# EAGLE design MMC_DSP_interface (EAGLE 9.5.1)

## Sheet 1 of 5: DSP Connections
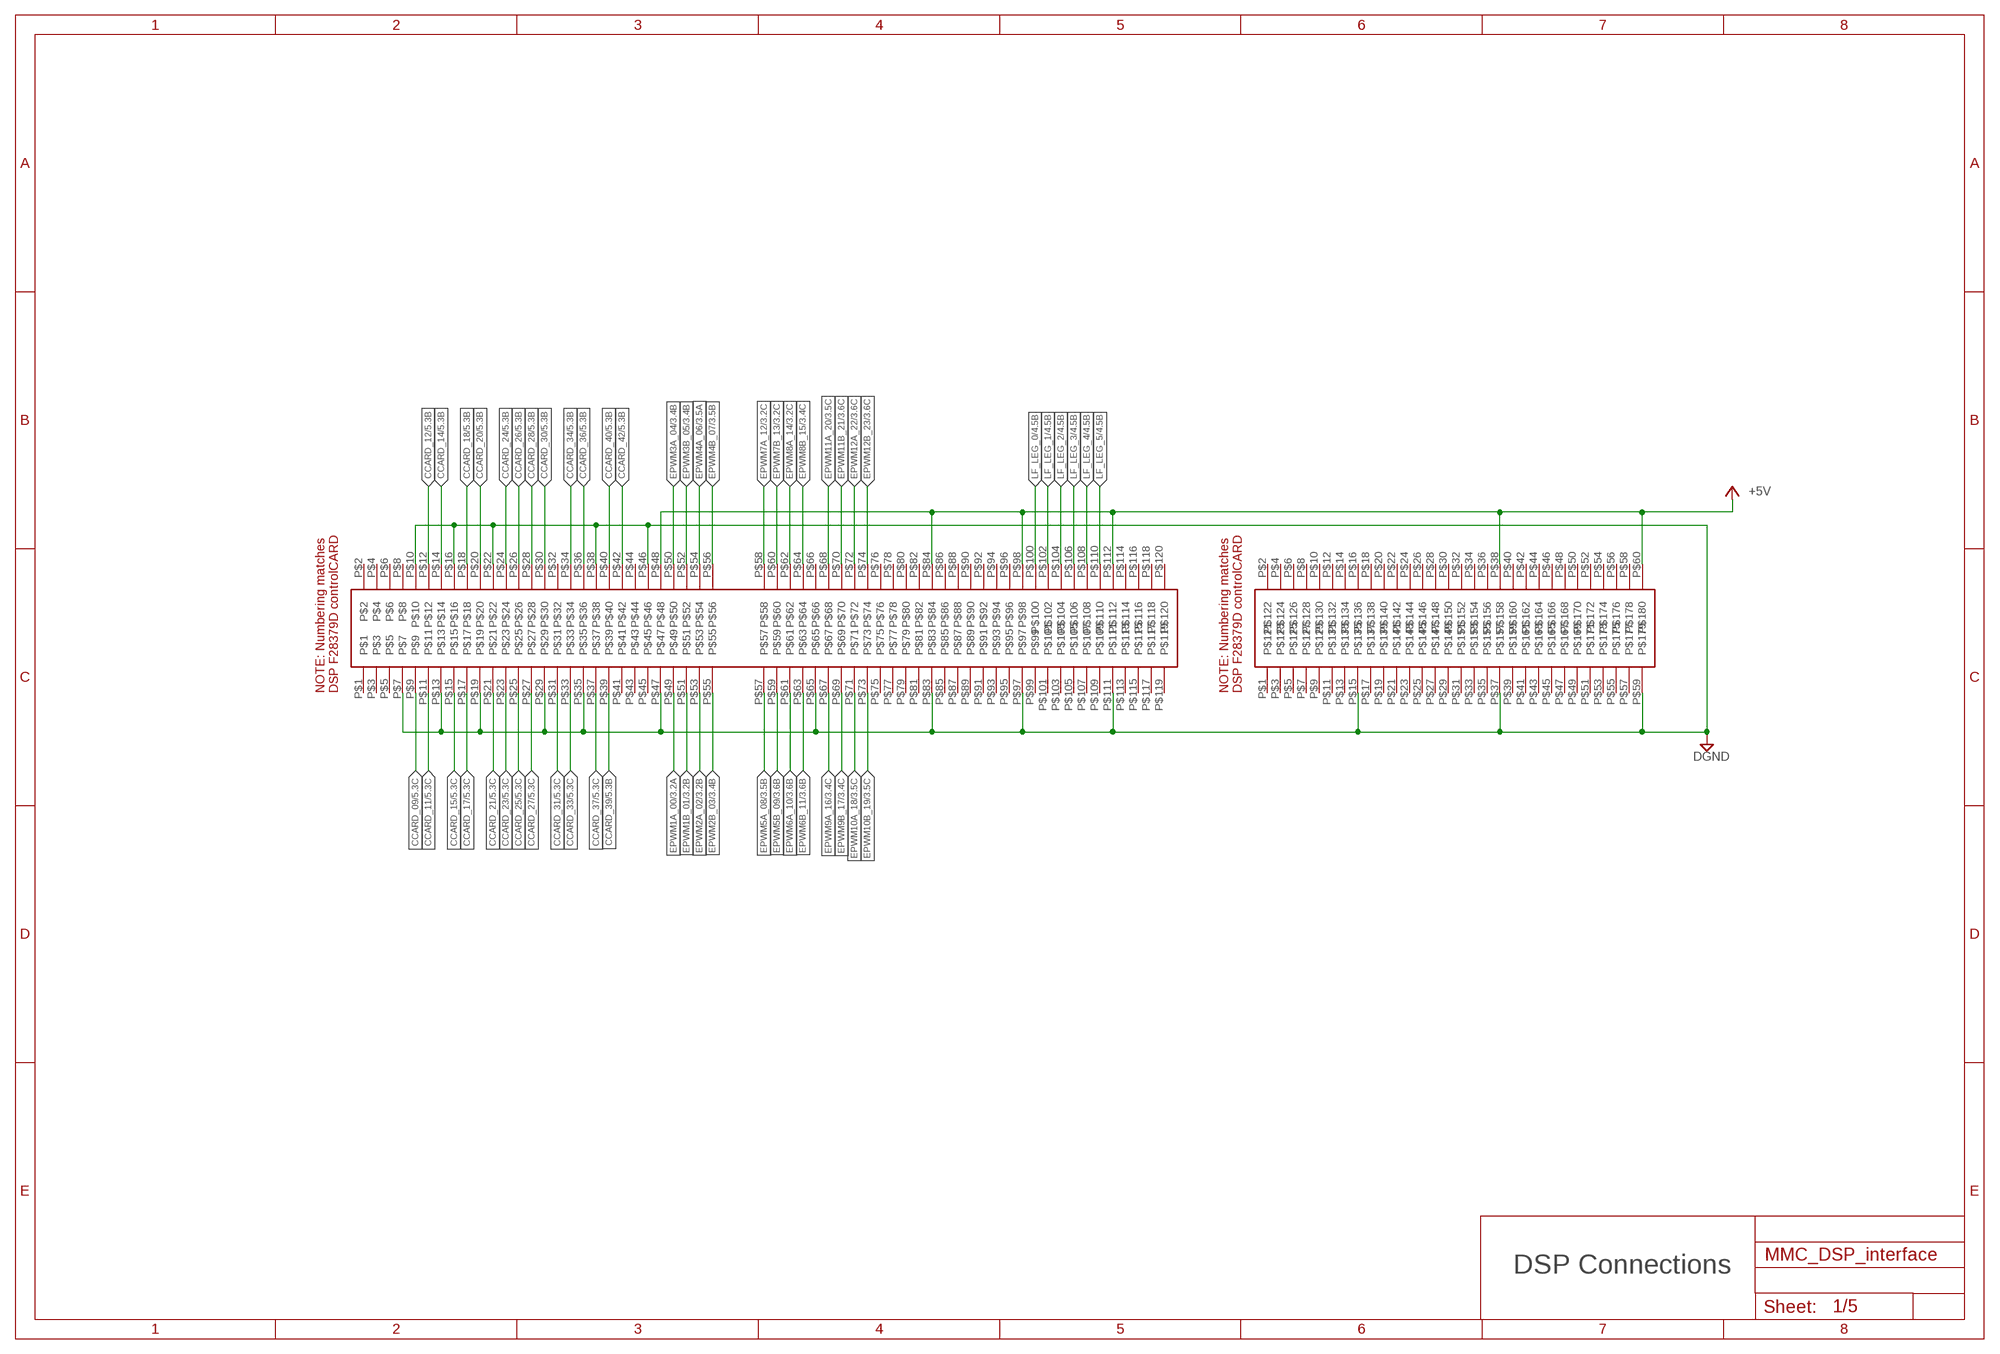
[diagram p0: schematic, sheet 1]

### Parts
U$1  HSEC8-160-01-L-DV-A-BL  [HSEC8-160-01-L-DV-A-BL]
U$2  HSEC8-130-01-SM-DV-A  [HSEC8-130-01-SM-DV-A]

### Nets
+5V: U$1.P$48 U$1.P$84 U$1.P$98 U$1.P$112 U$2.P$38 U$2.P$60 ; also sheet 2,3,4
CCARD_09: U$1.P$9 ; also sheet 5
CCARD_11: U$1.P$11 ; also sheet 5
CCARD_12: U$1.P$12 ; also sheet 5
CCARD_14: U$1.P$14 ; also sheet 5
CCARD_15: U$1.P$15 ; also sheet 5
CCARD_17: U$1.P$17 ; also sheet 5
CCARD_18: U$1.P$18 ; also sheet 5
CCARD_20: U$1.P$20 ; also sheet 5
CCARD_21: U$1.P$21 ; also sheet 5
CCARD_23: U$1.P$23 ; also sheet 5
CCARD_24: U$1.P$24 ; also sheet 5
CCARD_25: U$1.P$25 ; also sheet 5
CCARD_26: U$1.P$26 ; also sheet 5
CCARD_27: U$1.P$27 ; also sheet 5
CCARD_28: U$1.P$28 ; also sheet 5
CCARD_30: U$1.P$30 ; also sheet 5
CCARD_31: U$1.P$31 ; also sheet 5
CCARD_33: U$1.P$33 ; also sheet 5
CCARD_34: U$1.P$34 ; also sheet 5
CCARD_36: U$1.P$36 ; also sheet 5
CCARD_37: U$1.P$37 ; also sheet 5
CCARD_39: U$1.P$39 ; also sheet 5
CCARD_40: U$1.P$40 ; also sheet 5
CCARD_42: U$1.P$42 ; also sheet 5
DGND: U$1.P$7 U$1.P$10 U$1.P$13 U$1.P$16 U$1.P$19 U$1.P$22 U$1.P$29 U$1.P$35 U$1.P$38 U$1.P$46 U$1.P$47 U$1.P$65 U$1.P$83 U$1.P$97 U$1.P$111 U$2.P$15 U$2.P$37 U$2.P$59 ; also sheet 2,3,4
EPWM1A_00: U$1.P$49 ; also sheet 3
EPWM1B_01: U$1.P$51 ; also sheet 3
EPWM2A_02: U$1.P$53 ; also sheet 3
EPWM2B_03: U$1.P$55 ; also sheet 3
EPWM3A_04: U$1.P$50 ; also sheet 3
EPWM3B_05: U$1.P$52 ; also sheet 3
EPWM4A_06: U$1.P$54 ; also sheet 3
EPWM4B_07: U$1.P$56 ; also sheet 3
EPWM5A_08: U$1.P$57 ; also sheet 3
EPWM5B_09: U$1.P$59 ; also sheet 3
EPWM6A_10: U$1.P$61 ; also sheet 3
EPWM6B_11: U$1.P$63 ; also sheet 3
EPWM7A_12: U$1.P$58 ; also sheet 3
EPWM7B_13: U$1.P$60 ; also sheet 3
EPWM8A_14: U$1.P$62 ; also sheet 3
EPWM8B_15: U$1.P$64 ; also sheet 3
EPWM9A_16: U$1.P$67 ; also sheet 3
EPWM9B_17: U$1.P$69 ; also sheet 3
EPWM10A_18: U$1.P$71 ; also sheet 3
EPWM10B_19: U$1.P$73 ; also sheet 3
EPWM11A_20: U$1.P$68 ; also sheet 3
EPWM11B_21: U$1.P$70 ; also sheet 3
EPWM12A_22: U$1.P$72 ; also sheet 3
EPWM12B_23: U$1.P$74 ; also sheet 3
LF_LEG_0: U$1.P$100 ; also sheet 4
LF_LEG_1: U$1.P$102 ; also sheet 4
LF_LEG_2: U$1.P$104 ; also sheet 4
LF_LEG_3: U$1.P$106 ; also sheet 4
LF_LEG_4: U$1.P$108 ; also sheet 4
LF_LEG_5: U$1.P$110 ; also sheet 4
Unconnected: U$1.P$1 U$1.P$2 U$1.P$3 U$1.P$4 U$1.P$5 U$1.P$6 U$1.P$8 U$1.P$32 U$1.P$41 U$1.P$43 U$1.P$44 U$1.P$45 U$1.P$66 U$1.P$75 U$1.P$76 U$1.P$77 U$1.P$78 U$1.P$79 U$1.P$80 U$1.P$81 U$1.P$82 U$1.P$85 U$1.P$86 U$1.P$87 U$1.P$88 U$1.P$89 U$1.P$90 U$1.P$91 U$1.P$92 U$1.P$93 U$1.P$94 U$1.P$95 U$1.P$96 U$1.P$99 U$1.P$101 U$1.P$103 U$1.P$105 U$1.P$107 U$1.P$109 U$1.P$113 U$1.P$114 U$1.P$115 U$1.P$116 U$1.P$117 U$1.P$118 U$1.P$119 U$1.P$120 U$2.P$1 U$2.P$2 U$2.P$3 U$2.P$4 U$2.P$5 U$2.P$6 U$2.P$7 U$2.P$8 U$2.P$9 U$2.P$10 U$2.P$11 U$2.P$12 U$2.P$13 U$2.P$14 U$2.P$16 U$2.P$17 U$2.P$18 U$2.P$19 U$2.P$20 U$2.P$21 U$2.P$22 U$2.P$23 U$2.P$24 U$2.P$25 U$2.P$26 U$2.P$27 U$2.P$28 U$2.P$29 U$2.P$30 U$2.P$31 U$2.P$32 U$2.P$33 U$2.P$34 U$2.P$35 U$2.P$36 U$2.P$39 U$2.P$40 U$2.P$41 U$2.P$42 U$2.P$43 U$2.P$44 U$2.P$45 U$2.P$46 U$2.P$47 U$2.P$48 U$2.P$49 U$2.P$50 U$2.P$51 U$2.P$52 U$2.P$53 U$2.P$54 U$2.P$55 U$2.P$56 U$2.P$57 U$2.P$58

### Notes on the sheet
- DSP Connections

## Sheet 2 of 5: Power
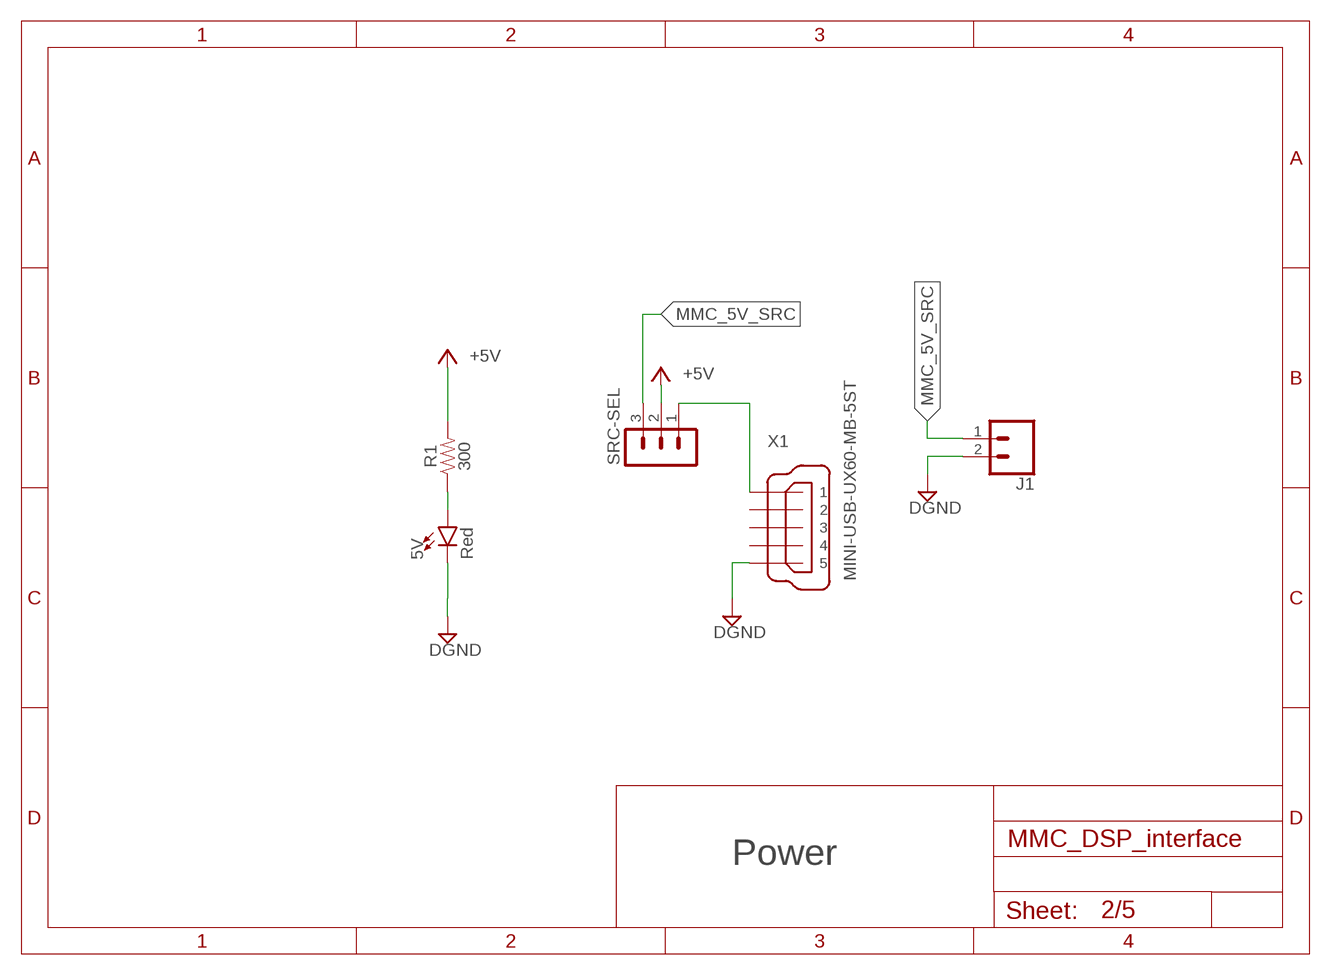
[diagram p1: schematic, sheet 2]

### Parts
5V  Red  LED-RED0603-SMART  [LED-0603]
J1  CONN_02  [1X02]
R1  300  300OHM-0603-1/10W-1%  [0603]
SRC-SEL  MA03-1  [MA03-1]
X1  MINI-USB-UX60-MB-5ST  [UX60-MB-5ST]

### Nets
+5V: R1.2 SRC-SEL.2 ; also sheet 1,3,4
DGND: 5V.C J1.2 X1.5 ; also sheet 1,3,4
MMC_5V_SRC: J1.1 SRC-SEL.3
N$1: SRC-SEL.1 X1.1
N$4: 5V.A R1.1
Unconnected: X1.2 X1.3 X1.4

### Notes on the sheet
- Power

## Sheet 3 of 5: PWM Connections
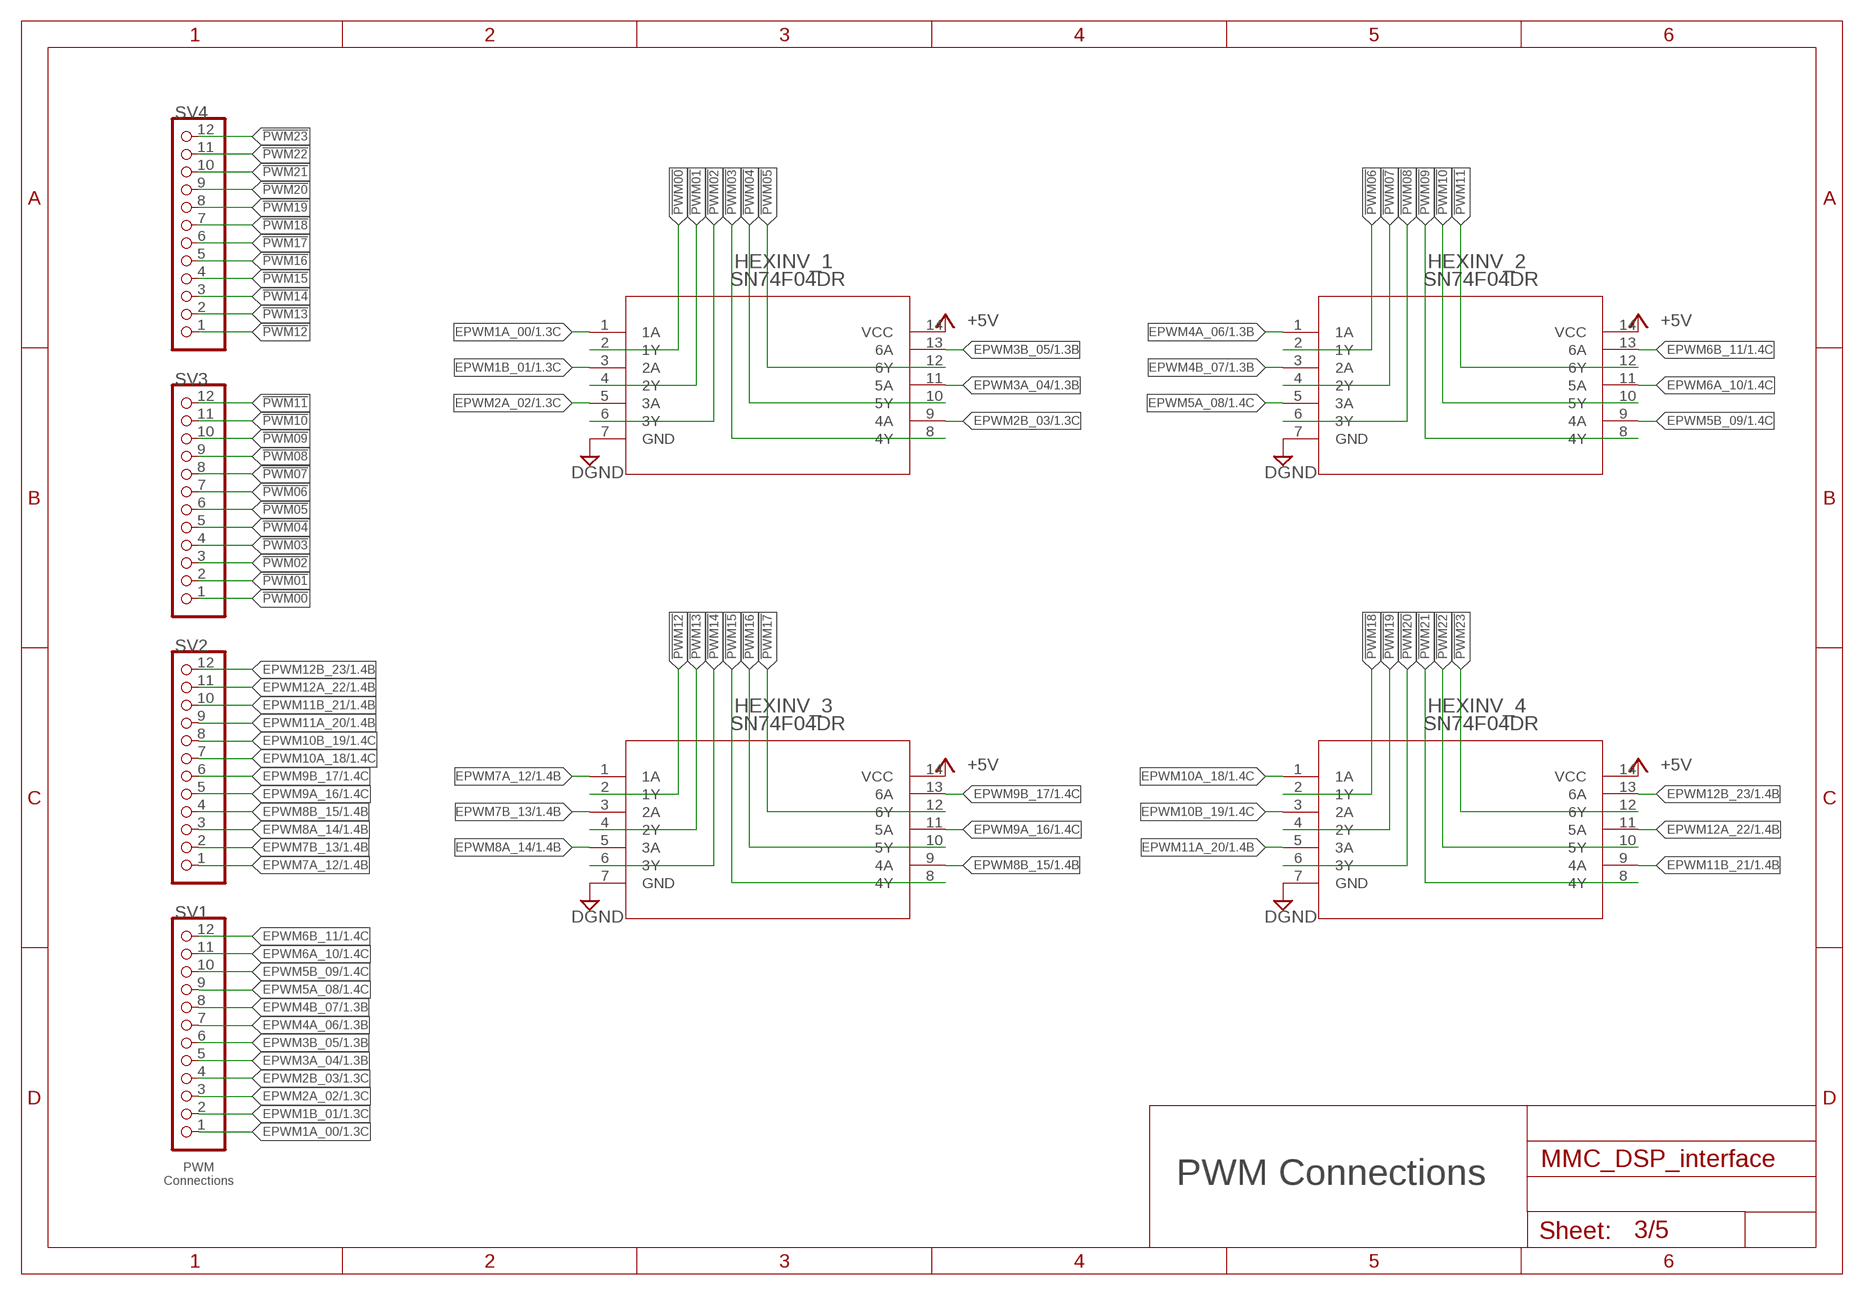
[diagram p2: schematic, sheet 3]

### Parts
HEXINV_1  SN74F04DR  [D14]
HEXINV_2  SN74F04DR  [D14]
HEXINV_3  SN74F04DR  [D14]
HEXINV_4  SN74F04DR  [D14]
SV1  PINHD-1X12-CB  [1X12-CB]
SV2  PINHD-1X12-CB  [1X12-CB]
SV3  PINHD-1X12-CB  [1X12-CB]
SV4  PINHD-1X12-CB  [1X12-CB]

### Nets
!PWM00: HEXINV_1.2(1Y) SV3.1
!PWM01: HEXINV_1.4(2Y) SV3.2
!PWM02: HEXINV_1.6(3Y) SV3.3
!PWM03: HEXINV_1.8(4Y) SV3.4
!PWM04: HEXINV_1.10(5Y) SV3.5
!PWM05: HEXINV_1.12(6Y) SV3.6
!PWM06: HEXINV_2.2(1Y) SV3.7
!PWM07: HEXINV_2.4(2Y) SV3.8
!PWM08: HEXINV_2.6(3Y) SV3.9
!PWM09: HEXINV_2.8(4Y) SV3.10
!PWM10: HEXINV_2.10(5Y) SV3.11
!PWM11: HEXINV_2.12(6Y) SV3.12
!PWM12: HEXINV_3.2(1Y) SV4.1
!PWM13: HEXINV_3.4(2Y) SV4.2
!PWM14: HEXINV_3.6(3Y) SV4.3
!PWM15: HEXINV_3.8(4Y) SV4.4
!PWM16: HEXINV_3.10(5Y) SV4.5
!PWM17: HEXINV_3.12(6Y) SV4.6
!PWM18: HEXINV_4.2(1Y) SV4.7
!PWM19: HEXINV_4.4(2Y) SV4.8
!PWM20: HEXINV_4.6(3Y) SV4.9
!PWM21: HEXINV_4.8(4Y) SV4.10
!PWM22: HEXINV_4.10(5Y) SV4.11
!PWM23: HEXINV_4.12(6Y) SV4.12
+5V: HEXINV_1.14(VCC) HEXINV_2.14(VCC) HEXINV_3.14(VCC) HEXINV_4.14(VCC) ; also sheet 1,2,4
DGND: HEXINV_1.7(GND) HEXINV_2.7(GND) HEXINV_3.7(GND) HEXINV_4.7(GND) ; also sheet 1,2,4
EPWM1A_00: HEXINV_1.1(1A) SV1.1 ; also sheet 1
EPWM1B_01: HEXINV_1.3(2A) SV1.2 ; also sheet 1
EPWM2A_02: HEXINV_1.5(3A) SV1.3 ; also sheet 1
EPWM2B_03: HEXINV_1.9(4A) SV1.4 ; also sheet 1
EPWM3A_04: HEXINV_1.11(5A) SV1.5 ; also sheet 1
EPWM3B_05: HEXINV_1.13(6A) SV1.6 ; also sheet 1
EPWM4A_06: HEXINV_2.1(1A) SV1.7 ; also sheet 1
EPWM4B_07: HEXINV_2.3(2A) SV1.8 ; also sheet 1
EPWM5A_08: HEXINV_2.5(3A) SV1.9 ; also sheet 1
EPWM5B_09: HEXINV_2.9(4A) SV1.10 ; also sheet 1
EPWM6A_10: HEXINV_2.11(5A) SV1.11 ; also sheet 1
EPWM6B_11: HEXINV_2.13(6A) SV1.12 ; also sheet 1
EPWM7A_12: HEXINV_3.1(1A) SV2.1 ; also sheet 1
EPWM7B_13: HEXINV_3.3(2A) SV2.2 ; also sheet 1
EPWM8A_14: HEXINV_3.5(3A) SV2.3 ; also sheet 1
EPWM8B_15: HEXINV_3.9(4A) SV2.4 ; also sheet 1
EPWM9A_16: HEXINV_3.11(5A) SV2.5 ; also sheet 1
EPWM9B_17: HEXINV_3.13(6A) SV2.6 ; also sheet 1
EPWM10A_18: HEXINV_4.1(1A) SV2.7 ; also sheet 1
EPWM10B_19: HEXINV_4.3(2A) SV2.8 ; also sheet 1
EPWM11A_20: HEXINV_4.5(3A) SV2.9 ; also sheet 1
EPWM11B_21: HEXINV_4.9(4A) SV2.10 ; also sheet 1
EPWM12A_22: HEXINV_4.11(5A) SV2.11 ; also sheet 1
EPWM12B_23: HEXINV_4.13(6A) SV2.12 ; also sheet 1

### Notes on the sheet
- PWM
  Connections
- PWM Connections

## Sheet 4 of 5: GPIO NOT gates
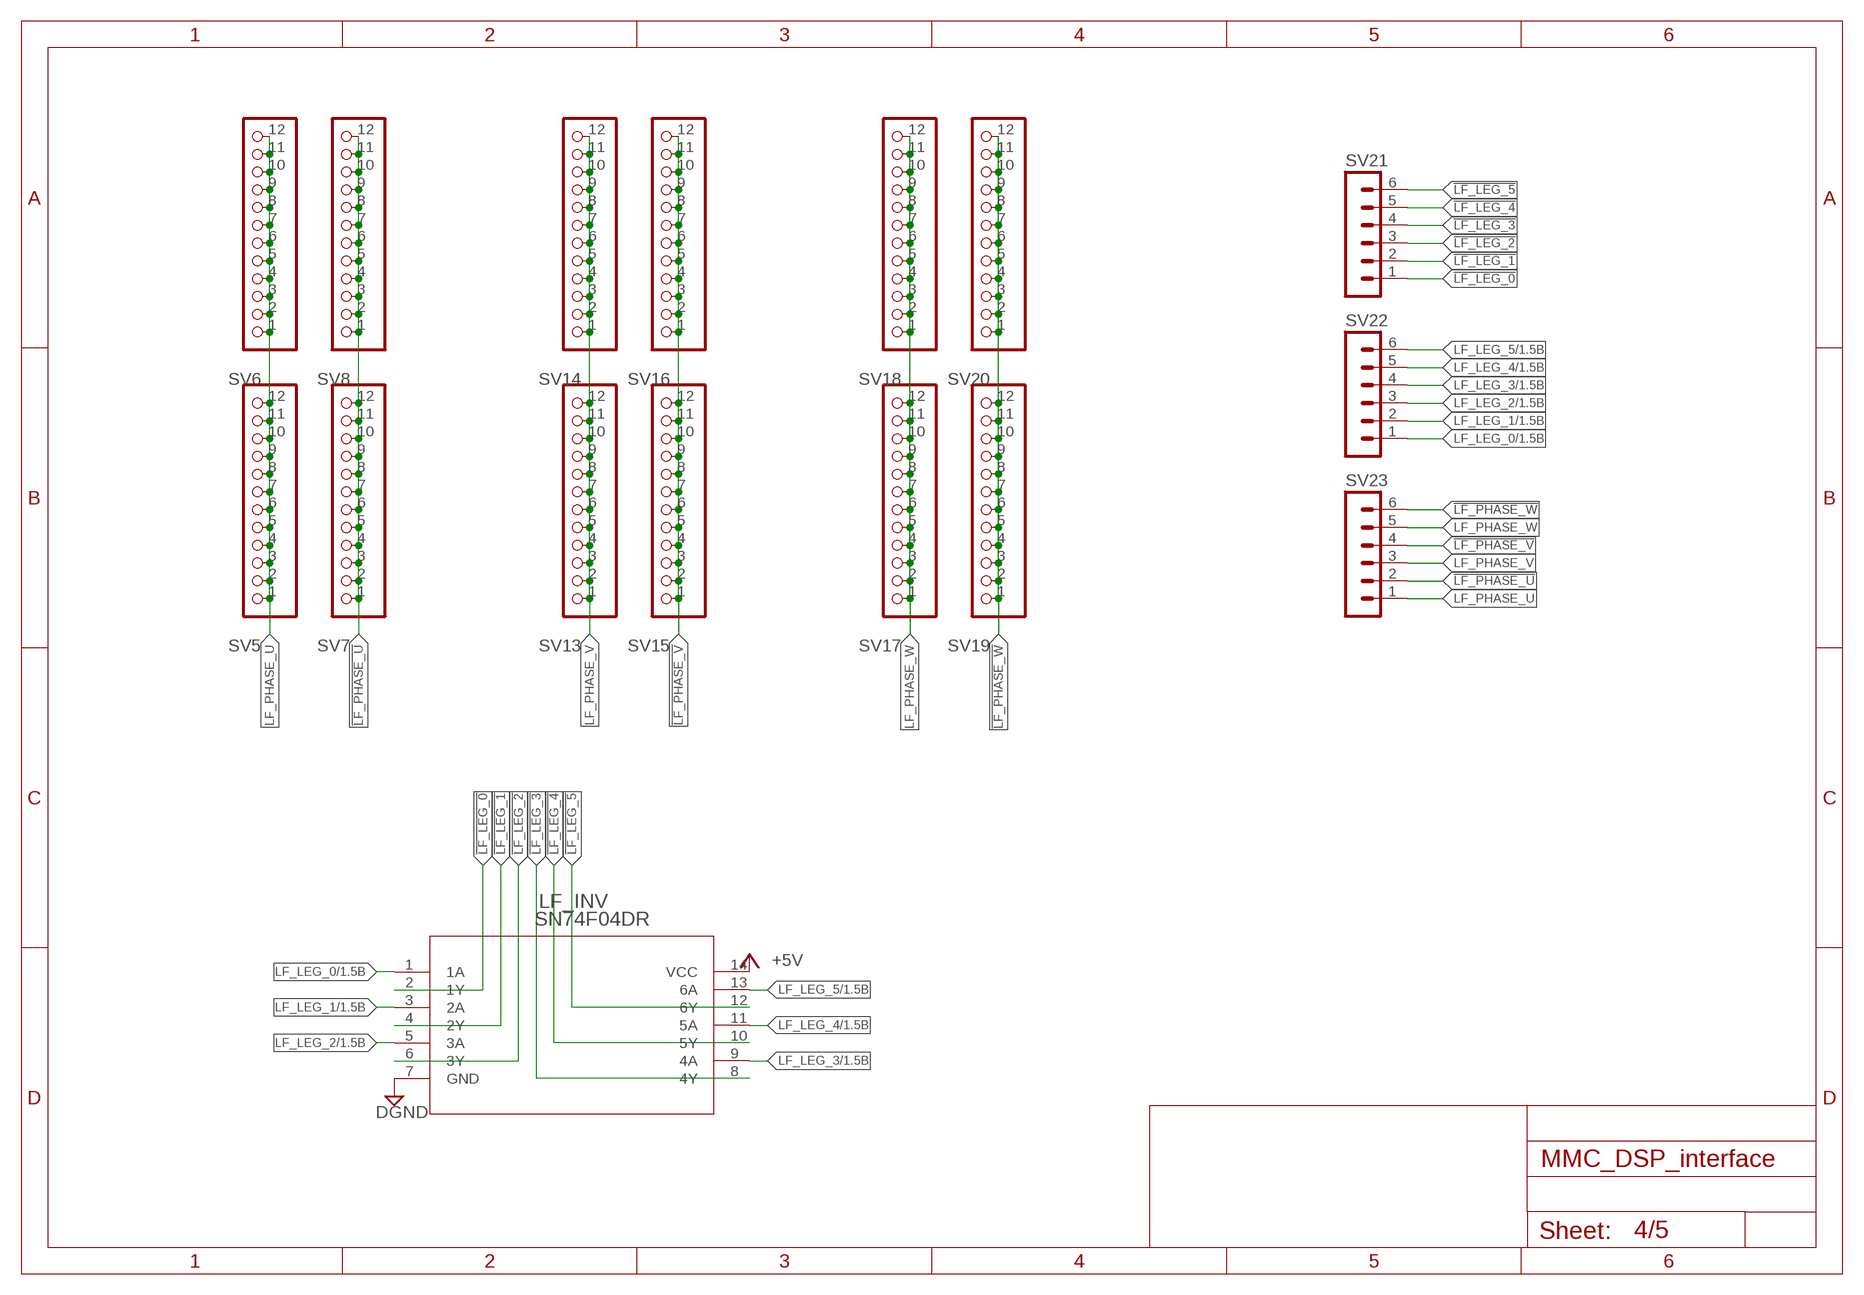
[diagram p3: schematic, sheet 4]

### Parts
LF_INV  SN74F04DR  [D14]
SV5  PINHD-1X12-CB  [1X12-CB]
SV6  PINHD-1X12-CB  [1X12-CB]
SV7  PINHD-1X12-CB  [1X12-CB]
SV8  PINHD-1X12-CB  [1X12-CB]
SV13  PINHD-1X12-CB  [1X12-CB]
SV14  PINHD-1X12-CB  [1X12-CB]
SV15  PINHD-1X12-CB  [1X12-CB]
SV16  PINHD-1X12-CB  [1X12-CB]
SV17  PINHD-1X12-CB  [1X12-CB]
SV18  PINHD-1X12-CB  [1X12-CB]
SV19  PINHD-1X12-CB  [1X12-CB]
SV20  PINHD-1X12-CB  [1X12-CB]
SV21  MA06-1  [MA06-1]
SV22  MA06-1  [MA06-1]
SV23  MA06-1  [MA06-1]

### Nets
!LF_LEG_0: LF_INV.2(1Y) SV21.1
!LF_LEG_1: LF_INV.4(2Y) SV21.2
!LF_LEG_2: LF_INV.6(3Y) SV21.3
!LF_LEG_3: LF_INV.8(4Y) SV21.4
!LF_LEG_4: LF_INV.10(5Y) SV21.5
!LF_LEG_5: LF_INV.12(6Y) SV21.6
!LF_PHASE_U: SV7.1 SV7.2 SV7.3 SV7.4 SV7.5 SV7.6 SV7.7 SV7.8 SV7.9 SV7.10 SV7.11 SV7.12 SV8.1 SV8.2 SV8.3 SV8.4 SV8.5 SV8.6 SV8.7 SV8.8 SV8.9 SV8.10 SV8.11 SV8.12 SV23.2
!LF_PHASE_V: SV15.1 SV15.2 SV15.3 SV15.4 SV15.5 SV15.6 SV15.7 SV15.8 SV15.9 SV15.10 SV15.11 SV15.12 SV16.1 SV16.2 SV16.3 SV16.4 SV16.5 SV16.6 SV16.7 SV16.8 SV16.9 SV16.10 SV16.11 SV16.12 SV23.4
!LF_PHASE_W: SV19.1 SV19.2 SV19.3 SV19.4 SV19.5 SV19.6 SV19.7 SV19.8 SV19.9 SV19.10 SV19.11 SV19.12 SV20.1 SV20.2 SV20.3 SV20.4 SV20.5 SV20.6 SV20.7 SV20.8 SV20.9 SV20.10 SV20.11 SV20.12 SV23.6
+5V: LF_INV.14(VCC) ; also sheet 1,2,3
DGND: LF_INV.7(GND) ; also sheet 1,2,3
LF_LEG_0: LF_INV.1(1A) SV22.1 ; also sheet 1
LF_LEG_1: LF_INV.3(2A) SV22.2 ; also sheet 1
LF_LEG_2: LF_INV.5(3A) SV22.3 ; also sheet 1
LF_LEG_3: LF_INV.9(4A) SV22.4 ; also sheet 1
LF_LEG_4: LF_INV.11(5A) SV22.5 ; also sheet 1
LF_LEG_5: LF_INV.13(6A) SV22.6 ; also sheet 1
LF_PHASE_U: SV5.1 SV5.2 SV5.3 SV5.4 SV5.5 SV5.6 SV5.7 SV5.8 SV5.9 SV5.10 SV5.11 SV5.12 SV6.1 SV6.2 SV6.3 SV6.4 SV6.5 SV6.6 SV6.7 SV6.8 SV6.9 SV6.10 SV6.11 SV6.12 SV23.1
LF_PHASE_V: SV13.1 SV13.2 SV13.3 SV13.4 SV13.5 SV13.6 SV13.7 SV13.8 SV13.9 SV13.10 SV13.11 SV13.12 SV14.1 SV14.2 SV14.3 SV14.4 SV14.5 SV14.6 SV14.7 SV14.8 SV14.9 SV14.10 SV14.11 SV14.12 SV23.3
LF_PHASE_W: SV17.1 SV17.2 SV17.3 SV17.4 SV17.5 SV17.6 SV17.7 SV17.8 SV17.9 SV17.10 SV17.11 SV17.12 SV18.1 SV18.2 SV18.3 SV18.4 SV18.5 SV18.6 SV18.7 SV18.8 SV18.9 SV18.10 SV18.11 SV18.12 SV23.5

## Sheet 5 of 5: Analog Connections
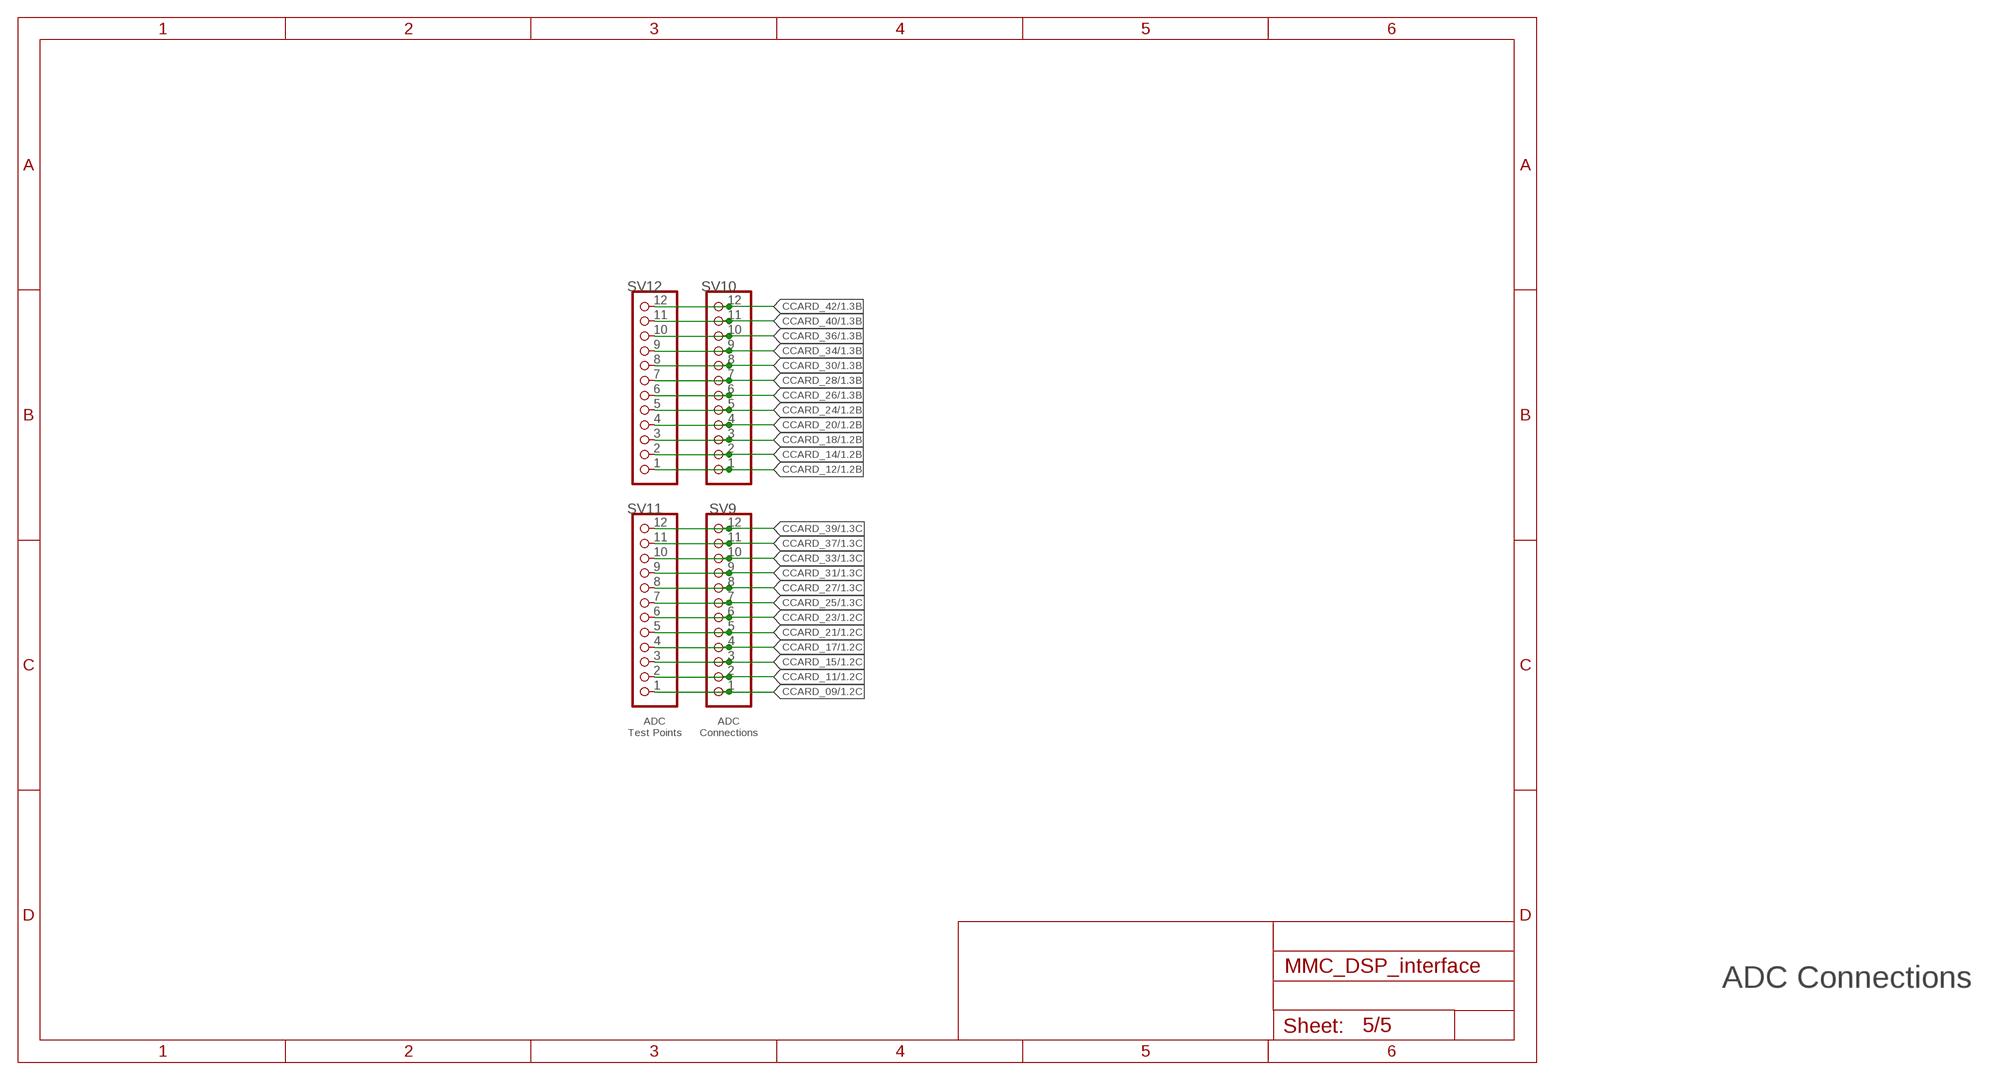
[diagram p4: schematic, sheet 5]

### Parts
SV9  PINHD-1X12-CB  [1X12-CB]
SV10  PINHD-1X12-CB  [1X12-CB]
SV11  PINHD-1X12-CB  [1X12-CB]
SV12  PINHD-1X12-CB  [1X12-CB]

### Nets
CCARD_09: SV9.1 SV11.1 ; also sheet 1
CCARD_11: SV9.2 SV11.2 ; also sheet 1
CCARD_12: SV10.1 SV12.1 ; also sheet 1
CCARD_14: SV10.2 SV12.2 ; also sheet 1
CCARD_15: SV9.3 SV11.3 ; also sheet 1
CCARD_17: SV9.4 SV11.4 ; also sheet 1
CCARD_18: SV10.3 SV12.3 ; also sheet 1
CCARD_20: SV10.4 SV12.4 ; also sheet 1
CCARD_21: SV9.5 SV11.5 ; also sheet 1
CCARD_23: SV9.6 SV11.6 ; also sheet 1
CCARD_24: SV10.5 SV12.5 ; also sheet 1
CCARD_25: SV9.7 SV11.7 ; also sheet 1
CCARD_26: SV10.6 SV12.6 ; also sheet 1
CCARD_27: SV9.8 SV11.8 ; also sheet 1
CCARD_28: SV10.7 SV12.7 ; also sheet 1
CCARD_30: SV10.8 SV12.8 ; also sheet 1
CCARD_31: SV9.9 SV11.9 ; also sheet 1
CCARD_33: SV9.10 SV11.10 ; also sheet 1
CCARD_34: SV10.9 SV12.9 ; also sheet 1
CCARD_36: SV10.10 SV12.10 ; also sheet 1
CCARD_37: SV9.11 SV11.11 ; also sheet 1
CCARD_39: SV9.12 SV11.12 ; also sheet 1
CCARD_40: SV10.11 SV12.11 ; also sheet 1
CCARD_42: SV10.12 SV12.12 ; also sheet 1

### Notes on the sheet
- ADC
  Test Points
- ADC
  Connections
- ADC Connections

## Library data of the parts
5V = SparkFun-LED:LED-RED: Red SMD LED Used in manufacturing of most products at SparkFun Packages: 0603 - SMD 0603 package [Product Link] <http://docs.avagotech.com/docs/AV02-0551EN> 0603 SMART - SMD 0603 SMART package ( more efficient and expensive)[Product Link] <http://www.osram-os.com/Graphics/XPic2/00077099_0.pdf> 1206 - SMD1206 package [Product Link] <https://www.sparkfun.com/datasheets/DevTools/LilyPad/Q150OVS4.pdff> SparkFun Products: Pro Mini 328 -5V <https://www.sparkfun.com/products/821> RedBoard <https://www.sparkfun.com/products/12757> IOIO-OTG <https://www.sparkfun.com/products/13613>; PROD_ID: DIO-11154
HEXINV_1-HEXINV_4 LF_INV = SN74F04DR:SN74F04DR; MANUFACTURER_PART_NUMBER: SN74F04DR; VENDOR: Vendor
J1 = SparkFun-Connectors:CONN_02: Multi connection point. Often used as Generic Header-pin footprint for 0.1 inch spaced/style header connections On any of the 0.1 inch spaced packages, you can populate with these: Break Away Headers - Straight <https://www.sparkfun.com/products/116> (PRT-00116) Break Away Male Headers - Right Angle <https://www.sparkfun.com/products/553> (PRT-00553) Female Headers <https://www.sparkfun.com/products/115> (PRT-00115) Break Away Headers - Machine Pin <https://www.sparkfun.com/products/117> (PRT-00117) Break Away Female Headers - Swiss Machine Pin <https://www.sparkfun.com/products/743> (PRT-00743) For SCREWTERMINALS and SPRING TERMINALS visit here: Screw Terimnals on SparkFun.com <https://www.sparkfun.com/search/results?term=Screw+Terminals> (5mm/3.5mm/2.54mm spacing) This device is also useful as a general connection point to wire up your design to another part of your project. Our various solder wires solder well into these plated through hole pads. Hook-Up Wire - Assortment (Stranded, 22 AWG) <https://www.sparkfun.com/products/11375> (PRT-11375) Hook-Up Wire - Assortment (Solid Core, 22 AWG) <https://www.sparkfun.com/products/11367> (PRT-11367) View the entire wire category on our website here <https://www.sparkfun.com/categories/141> Special notes: Molex polarized connector foot print use with: PRT-08233 with associated crimp pins and housings. 2.54_SCREWTERM for use with PRT-10571. 3.5mm Screw Terminal footprints for PRT-08084 5mm Screw Terminal footprints for use with PRT-08432
R1 = SparkFun-Resistors:300OHM: 300Ω resistor A resistor is a passive two-terminal electrical component that implements electrical resistance as a circuit element. Resistors act to reduce current flow, and, at the same time, act to lower voltage levels within circuits. - Wikipedia; PROD_ID: RES_10328
SRC-SEL = con-lstb:MA03-1: PIN HEADER; OC_FARNELL: unknown; OC_NEWARK: unknown
SV1-SV20 = adafruit:PINHD-1X12: PIN HEADER
SV21-SV23 = con-lstb:MA06-1: PIN HEADER; OC_FARNELL: unknown; OC_NEWARK: unknown
U$1 = TristanLibrary:HSEC8-160-01-L-DV-A-BL
U$2 = TristanLibrary:HSEC8-130-01-SM-DV-A
X1 = con-hirose:MINI-USB-: MINI USB Connector Source: http://www.hirose.co.jp/cataloge_hp/e24000019.pdf; OC_FARNELL: unknown; OC_NEWARK: unknown

## Board
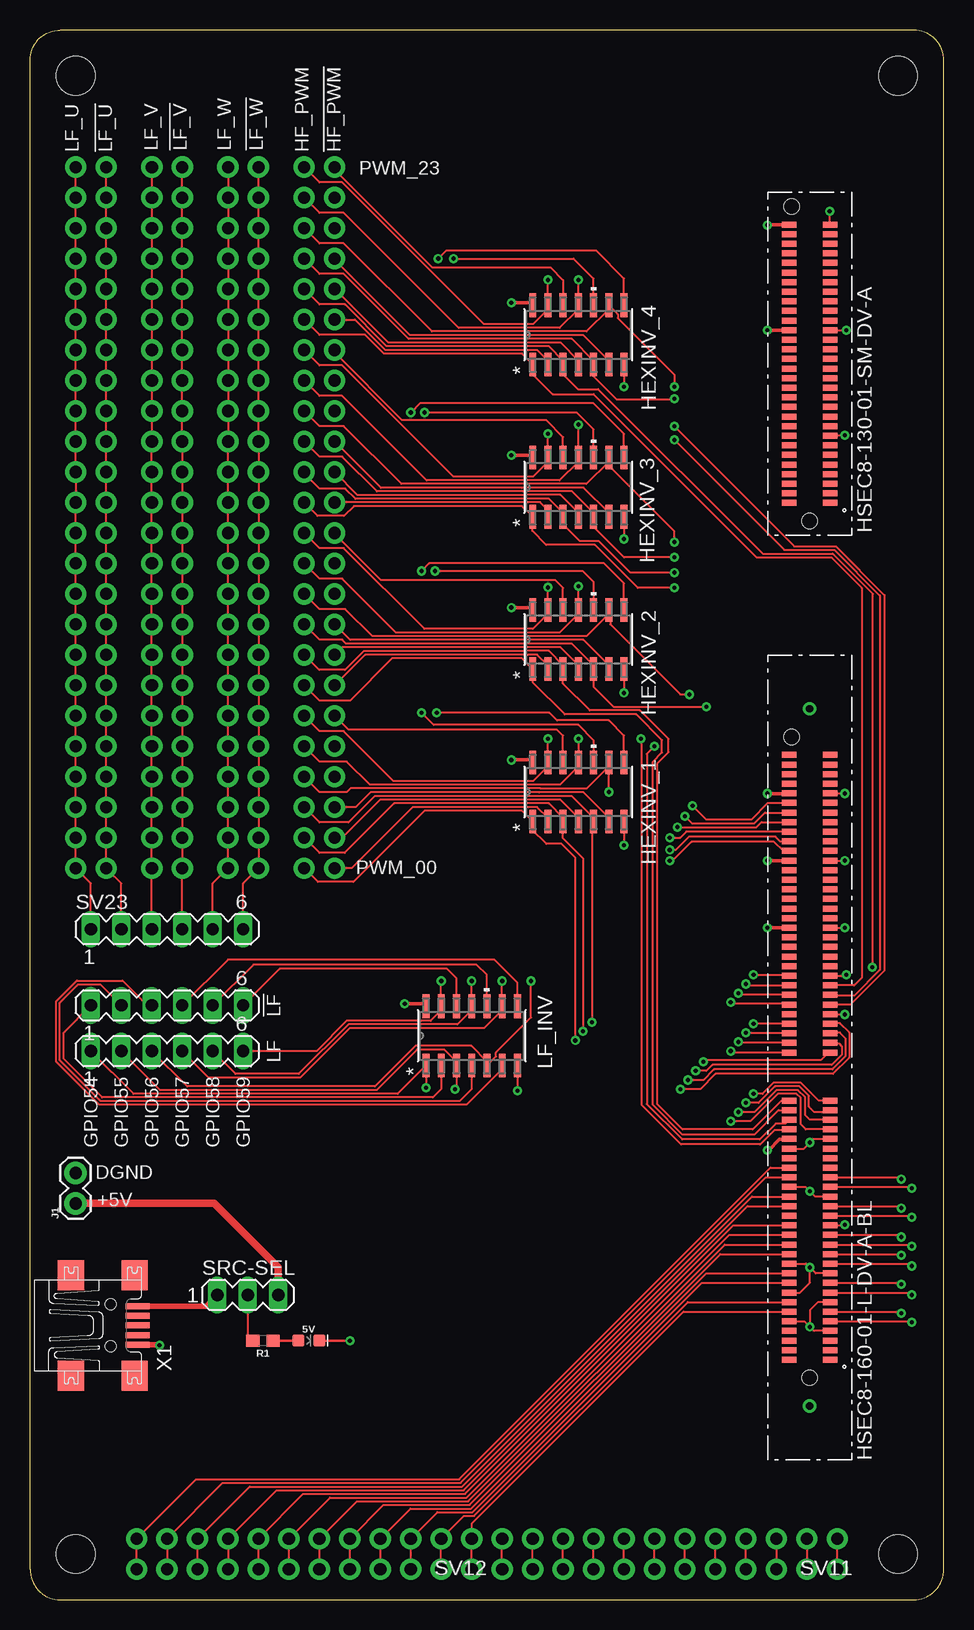
[diagram p5: board, top side]
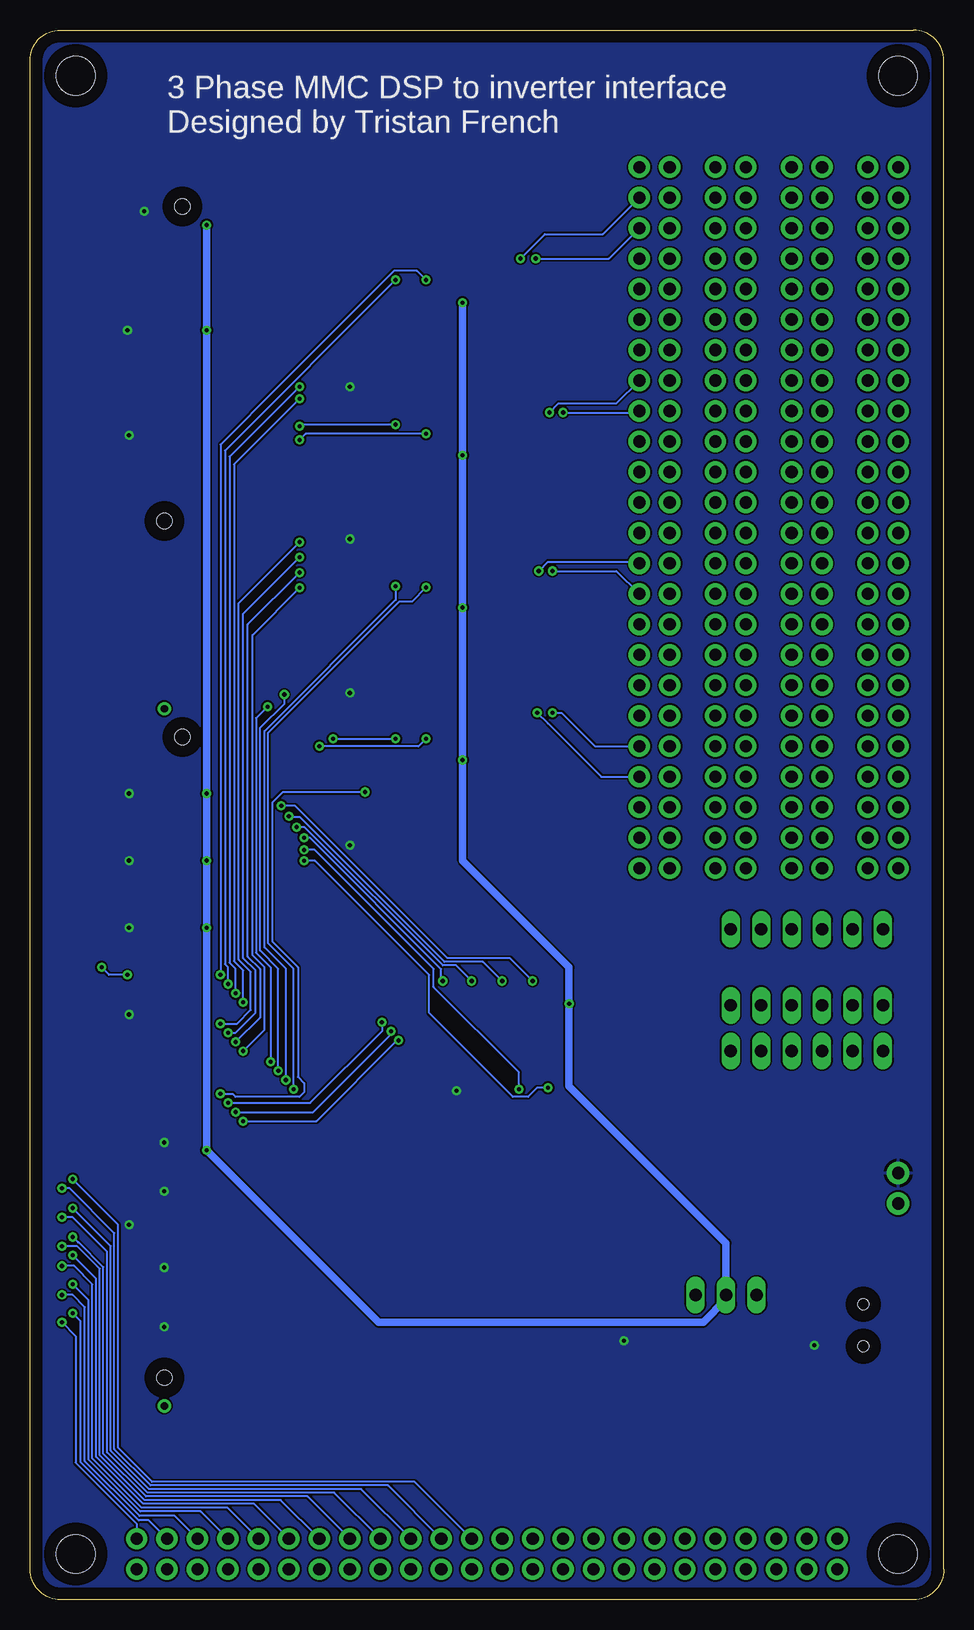
[diagram p6: board, bottom side, seen from below]

Size 76.2 x 130.81 mm. Coordinates in mm from the lower left corner, seen from the top.
Outline: 0,2.54 0,128.27 arc-90 2.54,130.81 73.66,130.81 arc-90 76.2,128.27 76.2,2.54 arc-90 73.64,0 2.54,0 arc-90 0,2.54
Copper layers (1*16): Top 0.035mm / dielectric 1.5mm / Bottom 0.035mm
Design rules "default *": minimum track width 6mil, minimum drill 0.35mm, track to track 6mil, track to pad 6mil, pad to pad 6mil, via to via 6mil, smd to smd 6mil, copper to edge 40mil, drill to drill 6mil, minimum pad ring 10mil, minimum via ring 8mil, stop-mask expansion 4mil, vias tented up to drill 0mil, thermal gap 10mil
Holes 3.2 mm at 3.81,3.81 72.39,3.81 72.39,127 3.81,127

### Footprints (pad centres in the part's own frame; a part is rotated, then mirrored left to right if it is on the bottom)
LED-0603 = smd 1 x 1: A -0.877,0; C 0.877,0
D14 = smd 1.97 x 0.568: 1 -2.464,3.81; 2 -2.464,2.54; 3 -2.464,1.27; 4 -2.464,0; 5 -2.464,-1.27; 6 -2.464,-2.54; 7 -2.464,-3.81; 8 2.464,-3.81; 9 2.464,-2.54; 10 2.464,-1.27; 11 2.464,0; 12 2.464,1.27; 13 2.464,2.54; 14 2.464,3.81
1X02 = drill 1.016 pad 1.88: 1 0,0; 2 2.54,0
0603 = smd 1.1 x 1: 1 -0.85,0; 2 0.85,0
MA03-1 = drill 1.016 long: 1 -2.54,0; 2 0,0; 3 2.54,0
1X12-CB = drill 1.016 pad 1.778: 1 -13.97,0; 2 -11.43,0; 3 -8.89,0; 4 -6.35,0; 5 -3.81,0; 6 -1.27,0; 7 1.27,0; 8 3.81,0; 9 6.35,0; 10 8.89,0; 11 11.43,0; 12 13.97,0
MA06-1 = drill 1.016 long: 1 -6.35,0; 2 -3.81,0; 3 -1.27,0; 4 1.27,0; 5 3.81,0; 6 6.35,0
HSEC8-160-01-L-DV-A-BL = smd 0.5 x 1.2: P$1 0,-1.7; P$2 0,1.7; P$3 0.8,-1.7; P$4 0.8,1.7; P$5 1.6,-1.7; P$6 1.6,1.7; P$7 2.4,-1.7; P$8 2.4,1.7; P$9 3.2,-1.7; P$10 3.2,1.7; P$11 4,-1.7; P$12 4,1.7; P$13 4.8,-1.7; P$14 4.8,1.7; P$15 5.6,-1.7; P$16 5.6,1.7; P$17 6.4,-1.7; P$18 6.4,1.7; P$19 7.2,-1.7; P$20 7.2,1.7; P$21 8,-1.7; P$22 8,1.7; P$23 8.8,-1.7; P$24 8.8,1.7; P$25 9.6,-1.7; P$26 9.6,1.7; P$27 10.4,-1.7; P$28 10.4,1.7; P$29 11.2,-1.7; P$30 11.2,1.7; P$31 12,-1.7; P$32 12,1.7; P$33 12.8,-1.7; P$34 12.8,1.7; P$35 13.6,-1.7; P$36 13.6,1.7; P$37 14.4,-1.7; P$38 14.4,1.7; P$39 15.2,-1.7; P$40 15.2,1.7; P$41 16,-1.7; P$42 16,1.7; P$43 16.8,-1.7; P$44 16.8,1.7; P$45 17.6,-1.7; P$46 17.6,1.7; P$47 18.4,-1.7; P$48 18.4,1.7; P$49 19.2,-1.7; P$50 19.2,1.7; P$51 20,-1.7; P$52 20,1.7; P$53 20.8,-1.7; P$54 20.8,1.7; P$55 21.6,-1.7; P$56 21.6,1.7; P$57 25.6,-1.7; P$58 25.6,1.7; P$59 26.4,-1.7; P$60 26.4,1.7; P$61 27.2,-1.7; P$62 27.2,1.7; P$63 28,-1.7; P$64 28,1.7; P$65 28.8,-1.7; P$66 28.8,1.7; P$67 29.6,-1.7; P$68 29.6,1.7; P$69 30.4,-1.7; P$70 30.4,1.7; P$71 31.2,-1.7; P$72 31.2,1.7; P$73 32,-1.7; P$74 32,1.7; P$75 32.8,-1.7; P$76 32.8,1.7; P$77 33.6,-1.7; P$78 33.6,1.7; P$79 34.4,-1.7; P$80 34.4,1.7; P$81 35.2,-1.7; P$82 35.2,1.7; P$83 36,-1.7; P$84 36,1.7; P$85 36.8,-1.7; P$86 36.8,1.7; P$87 37.6,-1.7; P$88 37.6,1.7; P$89 38.4,-1.7; P$90 38.4,1.7; P$91 39.2,-1.7; P$92 39.2,1.7; P$93 40,-1.7; P$94 40,1.7; P$95 40.8,-1.7; P$96 40.8,1.7; P$97 41.6,-1.7; P$98 41.6,1.7; P$99 42.4,-1.7; P$100 42.4,1.7; P$101 43.2,-1.7; P$102 43.2,1.7; P$103 44,-1.7; P$104 44,1.7; P$105 44.8,-1.7; P$106 44.8,1.7; P$107 45.6,-1.7; P$108 45.6,1.7; P$109 46.4,-1.7; P$110 46.4,1.7; P$111 47.2,-1.7; P$112 47.2,1.7; P$113 48,-1.7; P$114 48,1.7; P$115 48.8,-1.7; P$116 48.8,1.7; P$117 49.6,-1.7; P$118 49.6,1.7; P$119 50.4,-1.7; P$120 50.4,1.7 | drill 0.6: P$121 -3.85,0; P$122 54.25,0 | hole 1.27: -1.5,0; 51.9,1.5
HSEC8-130-01-SM-DV-A = smd 0.5 x 1.2: P$1 0,-1.7; P$2 0,1.7; P$3 0.8,-1.7; P$4 0.8,1.7; P$5 1.6,-1.7; P$6 1.6,1.7; P$7 2.4,-1.7; P$8 2.4,1.7; P$9 3.2,-1.7; P$10 3.2,1.7; P$11 4,-1.7; P$12 4,1.7; P$13 4.8,-1.7; P$14 4.8,1.7; P$15 5.6,-1.7; P$16 5.6,1.7; P$17 6.4,-1.7; P$18 6.4,1.7; P$19 7.2,-1.7; P$20 7.2,1.7; P$21 8,-1.7; P$22 8,1.7; P$23 8.8,-1.7; P$24 8.8,1.7; P$25 9.6,-1.7; P$26 9.6,1.7; P$27 10.4,-1.7; P$28 10.4,1.7; P$29 11.2,-1.7; P$30 11.2,1.7; P$31 12,-1.7; P$32 12,1.7; P$33 12.8,-1.7; P$34 12.8,1.7; P$35 13.6,-1.7; P$36 13.6,1.7; P$37 14.4,-1.7; P$38 14.4,1.7; P$39 15.2,-1.7; P$40 15.2,1.7; P$41 16,-1.7; P$42 16,1.7; P$43 16.8,-1.7; P$44 16.8,1.7; P$45 17.6,-1.7; P$46 17.6,1.7; P$47 18.4,-1.7; P$48 18.4,1.7; P$49 19.2,-1.7; P$50 19.2,1.7; P$51 20,-1.7; P$52 20,1.7; P$53 20.8,-1.7; P$54 20.8,1.7; P$55 21.6,-1.7; P$56 21.6,1.7; P$57 22.4,-1.7; P$58 22.4,1.7; P$59 23.2,-1.7; P$60 23.2,1.7 | hole 1.27: -1.5,0; 24.7,1.5
UX60-MB-5ST = smd 2 x 0.5: 1 2.25,1.6; 2 2.25,0.8; 3 2.25,0; 4 2.25,-0.8; 5 2.25,-1.6 | smd 2.2 x 2.5: M1 -3.3,-4.2; M2 -3.3,4.2; M3 2,4.2; M4 2,-4.2 | hole 0.9: 0,-1.75; 0,1.75

### Placement (x,y rotation side)
5V  23.24,21.59 0 top
HEXINV_1  45.72,67.31 90 top
HEXINV_2  45.72,80.01 90 top
HEXINV_3  45.72,92.71 90 top
HEXINV_4  45.72,105.41 90 top
J1  3.81,33.02 90 top
LF_INV  36.83,46.99 90 top
R1  19.43,21.59 180 top
SRC-SEL  18.16,25.4 0 top
SV1  22.86,74.93 90 top
SV2  22.86,105.41 90 top
SV3  25.4,74.93 90 top
SV4  25.4,105.41 90 top
SV5  3.81,74.93 90 top
SV6  3.81,105.41 90 top
SV7  6.35,74.93 90 top
SV8  6.35,105.41 90 top
SV9  53.34,2.54 180 top
SV10  22.86,2.54 180 top
SV11  53.34,5.08 180 top
SV12  22.86,5.08 180 top
SV13  10.16,74.93 90 top
SV14  10.16,105.41 90 top
SV15  12.7,74.93 90 top
SV16  12.7,105.41 90 top
SV17  16.51,74.93 90 top
SV18  16.51,105.41 90 top
SV19  19.05,74.93 90 top
SV20  19.05,105.41 90 top
SV21  11.43,49.53 0 top
SV22  11.43,45.72 0 top
SV23  11.43,55.88 0 top
U$1  65,20 90 top
U$2  65,91.4 90 top
X1  6.73,22.86 0 top

### Tracks (layer width: path | path; a pad name or v marks a point on that pad's centre or on a via)
!LF_LEG_0
  Top 0.152: LF_INV.2 34.29,42.55 33.6,41.86 6.02,41.86 2.79,45.09 2.79,47.24 SV21.1
!LF_LEG_1
  Top 0.152: LF_INV.4 36.83,42.55 35.83,41.55 5.89,41.55 2.49,44.96 2.49,49.73 4.04,51.28 5.87,51.28 SV21.2
!LF_LEG_2
  Top 0.152: LF_INV.6 39.37,44.2 36.42,41.25 5.77,41.25 2.18,44.83 2.18,48.11 2.16,48.13 2.18,48.16 2.18,49.86 3.91,51.59 7.73,51.59 9.78,49.53 SV21.3
!LF_LEG_3
  Top 0.152: LF_INV.8 40.64,51.43 38.73,53.34 16.51,53.34 SV21.4
!LF_LEG_4
  Top 0.152: LF_INV.10 38.1,52.06 37.23,52.93 18.64,52.93 SV21.5
!LF_LEG_5
  Top 0.152: LF_INV.12 35.56,51.81 34.79,52.58 20.83,52.58 SV21.6
!LF_PHASE_U
  Top 0.152: SV23.2 7.62,59.69 SV7.1 SV7.2 SV7.3 SV7.4 SV7.5 SV7.6 SV7.7 SV7.8 SV7.9 SV7.10 SV7.11 SV7.12 SV8.1 SV8.2 SV8.3 SV8.4 SV8.5 SV8.6 SV8.7 SV8.8 SV8.9 SV8.10 SV8.11 SV8.12
!LF_PHASE_V
  Top 0.152: SV23.4 SV15.1 SV15.2 SV15.3 SV15.4 SV15.5 SV15.6 SV15.7 SV15.8 SV15.9 SV15.10 SV15.11 SV15.12 SV16.1 SV16.2 SV16.3 SV16.4 SV16.5 SV16.6 SV16.7 SV16.8 SV16.9 SV16.10 SV16.11 SV16.12
!LF_PHASE_W
  Top 0.152: SV23.6 17.78,59.69 SV19.1 SV19.2 SV19.3 SV19.4 SV19.5 SV19.6 SV19.7 SV19.8 SV19.9 SV19.10 SV19.11 SV19.12 SV20.1 SV20.2 SV20.3 SV20.4 SV20.5 SV20.6 SV20.7 SV20.8 SV20.9 SV20.10 SV20.11 SV20.12
!PWM00
  Top 0.152: HEXINV_1.2 43.18,65.17 42.29,66.06 31.9,66.06 26.8,60.96 SV3.1
!PWM01
  Top 0.152: HEXINV_1.4 45.72,65.17 44.22,66.67 29.2,66.67 26.04,63.5 SV3.2
!PWM02
  Top 0.152: HEXINV_1.6 48.26,65.17 46.15,67.28 42.45,67.28 42.42,67.31 28.4,67.31 27.13,66.04 SV3.3
!PWM03  (via drill 0.35)
  Top 0.152: HEXINV_1.8 49.53,72 48.25,73.28 43.94,73.28 43.31,73.91 v33.91,73.91
  Bottom 0.152: v33.91,73.91 33.02,73.03 28.57,68.58 SV3.4
!PWM04  (via drill 0.35)
  Top 0.152: HEXINV_1.10 46.99,71.62 45.71,72.9 33.66,72.9 v32.64,73.91
  Bottom 0.152: v32.64,73.91 31.88,73.91 29.08,71.12 SV3.5
!PWM05
  Top 0.152: HEXINV_1.12 44.45,72 43.93,72.52 26.54,72.52 SV3.6
!PWM06
  Top 0.152: HEXINV_2.2 43.18,77.87 42.29,78.76 41.53,78.76 41.51,78.74 27.94,78.74 SV3.7
!PWM07
  Top 0.152: HEXINV_2.4 45.72,77.87 44.21,79.38 26.04,79.38 SV3.8
!PWM08
  Top 0.152: HEXINV_2.6 48.26,77.87 46.14,79.98 26.7,79.98 SV3.9
!PWM09  (via drill 0.35)
  Top 0.152: HEXINV_2.8 49.53,84.7 47.87,86.36 33.27,86.36 v32.64,85.72
  Bottom 0.152: v32.64,85.72 27.3,85.72 SV3.10
!PWM10  (via drill 0.35)
  Top 0.152: HEXINV_2.10 46.99,84.83 46.09,85.72 v33.78,85.72
  Bottom 0.152: v33.78,85.72 33.02,86.49 25.53,86.49 SV3.11
!PWM11
  Top 0.152: HEXINV_2.12 44.45,84.32 43.81,84.96 29.26,84.96 25.4,88.82 SV3.12
!PWM12
  Top 0.152: HEXINV_3.2 43.18,90.81 42.52,91.46 41.53,91.46 41.51,91.44 SV4.1
!PWM13
  Top 0.152: HEXINV_3.4 45.72,90.57 44.22,92.07 41.28,92.07 41.26,92.05 27.33,92.05 SV4.2
!PWM14
  Top 0.152: HEXINV_3.6 48.26,90.57 46.15,92.68 41.03,92.68 41.01,92.66 29.26,92.66 SV4.3
!PWM15  (via drill 0.35)
  Top 0.152: HEXINV_3.8 49.53,97.15 46.98,99.69 32.51,99.69 v31.75,98.93
  Bottom 0.152: v31.75,98.93 25.53,98.93 SV4.4
!PWM16  (via drill 0.35)
  Top 0.152: HEXINV_3.10 46.99,97.53 45.59,98.93 v32.89,98.93
  Bottom 0.152: v32.89,98.93 32.13,99.69 27.3,99.69 SV4.5
!PWM17
  Top 0.152: HEXINV_3.12 44.45,96.89 43.05,98.3 31.04,98.3 25.4,103.94 SV4.6
!PWM18
  Top 0.152: SV4.7 27.1,106.68 29.62,104.16 42.29,104.16 43.19,103.26 HEXINV_4.2
!PWM19
  Top 0.152: SV4.8 25.78,108.84 25.8,108.84 29.87,104.78 44.21,104.78 45.73,103.26 HEXINV_4.4
!PWM20
  Top 0.152: HEXINV_4.6 48.27,103.26 46.14,105.39 31.7,105.39 25.4,111.68 SV4.9
!PWM21  (via drill 0.35)
  Top 0.152: HEXINV_4.8 49.53,110.1 47.24,112.39 34.67,112.39 v34.04,111.76
  Bottom 0.152: v34.04,111.76 27.94,111.76 SV4.10
!PWM22  (via drill 0.35)
  Top 0.152: HEXINV_4.10 46.99,110.1 45.33,111.76 v35.31,111.76
  Bottom 0.152: v35.31,111.76 33.27,113.79 28.45,113.79 SV4.11
!PWM23
  Top 0.152: HEXINV_4.12 44.45,109.97 43.43,111 33.58,111 25.4,119.18 SV4.12
+5V  (via drill 0.35)
  Top 0.152: SRC-SEL.2 18.16,25.02 18.16,22.01 R1.2
  Top 0.305: v40.13,108.08 41.71,108.08 HEXINV_4.14 | v40.13,95.38 41.71,95.38 HEXINV_3.14 | v40.13,82.68 41.71,82.68 HEXINV_2.14 | v40.13,69.98 41.71,69.98 HEXINV_1.14 | v31.24,49.66 32.82,49.66 LF_INV.14 | v61.47,61.59 U$1.P$98 | v61.47,56.01 U$1.P$84 | U$2.P$60 61.51,114.6 v61.47,114.55 | v61.47,105.79 v61.48,105.8 U$2.P$38 | v61.47,37.47 61.59,37.47 62.48,38.35 63.25,38.35 U$1.P$48 | v61.47,67.18 63.28,67.18 U$1.P$112
  Bottom 0.61: v40.13,108.08 v40.13,95.38 v40.13,82.68 v40.13,69.98 40.13,61.59 31.24,52.7 v31.24,49.66 31.24,42.8 18.16,29.72 SRC-SEL.2 18.16,25.02 20.07,23.11 47.12,23.11 v61.47,37.47 v61.47,56.01 v61.47,61.59 v61.47,67.18 v61.47,105.79 v61.47,114.55
CCARD_09  (via drill 0.35)
  Top 0.152: SV9.1 SV11.1 | U$1.P$9 73.45,23.2 v73.53,23.11
  Bottom 0.152: SV11.1 67.31,6.35 72.39,11.43 72.39,21.97 v73.53,23.11
CCARD_11  (via drill 0.35)
  Top 0.152: SV11.2 SV9.2 | U$1.P$11 72.52,24 v72.64,23.88
  Bottom 0.152: SV11.2 66.29,6.6 67.13,6.6 72.01,11.48 72.01,23.24 v72.64,23.88
CCARD_12
  Top 0.152: SV10.1 SV12.1 36.83,6.35 54.48,24 U$1.P$12
CCARD_14
  Top 0.152: SV10.2 SV12.2 36.2,6.99 37.03,6.99 54.85,24.8 U$1.P$14
CCARD_15  (via drill 0.35)
  Top 0.152: U$1.P$15 73.33,25.6 v73.53,25.4 | SV11.3 SV9.3
  Bottom 0.152: SV11.3 64.14,6.99 67.06,6.99 71.63,11.56 71.63,24.38 72.64,25.4 v73.53,25.4
CCARD_17  (via drill 0.35)
  Top 0.152: U$1.P$17 72.53,26.4 v72.64,26.29 | SV9.4 SV11.4
  Bottom 0.152: SV11.4 61.98,7.37 67.01,7.37 71.32,11.68 71.32,24.97 v72.64,26.29
CCARD_18
  Top 0.152: SV10.3 SV12.3 33.96,7.29 36.91,7.29 56.02,26.4 U$1.P$18
CCARD_20
  Top 0.152: SV10.4 SV12.4 31.73,7.59 36.78,7.59 56.39,27.2 U$1.P$20
CCARD_21  (via drill 0.35)
  Top 0.152: U$1.P$21 73.35,28 v73.53,27.81 | SV9.5 SV11.5
  Bottom 0.152: SV11.5 59.74,7.67 66.88,7.67 70.99,11.78 70.99,26.29 72.52,27.81 v73.53,27.81
CCARD_23  (via drill 0.35)
  Top 0.152: U$1.P$23 72.55,28.8 v72.64,28.7 | SV9.6 SV11.6
  Bottom 0.152: SV11.6 57.53,8 66.78,8 70.69,11.91 70.69,26.75 v72.64,28.7
CCARD_24
  Top 0.152: SV10.5 SV12.5 29.49,7.9 36.66,7.9 57.56,28.8 U$1.P$24
CCARD_25  (via drill 0.35)
  Top 0.152: U$1.P$25 73.4,29.6 v73.53,29.46 | SV9.7 SV11.7
  Bottom 0.152: SV11.7 55.3,8.31 66.65,8.31 70.38,12.04 70.38,27.58 72.26,29.46 v73.53,29.46
CCARD_26
  Top 0.152: SV10.6 SV12.6 27.25,8.2 36.53,8.2 57.92,29.6 U$1.P$26
CCARD_27  (via drill 0.35)
  Top 0.152: U$1.P$27 72.47,30.4 v72.64,30.23 | SV9.8 SV11.8
  Bottom 0.152: SV11.8 53.06,8.61 66.53,8.61 70.08,12.16 70.08,27.71 72.14,29.77 72.19,29.77 v72.64,30.23
CCARD_28
  Top 0.152: SV10.7 SV12.7 25.02,8.51 36.4,8.51 58.29,30.4 U$1.P$28
CCARD_30
  Top 0.152: SV10.8 SV12.8 22.78,8.81 36.28,8.81 58.66,31.2 U$1.P$30
CCARD_31  (via drill 0.35)
  Top 0.152: U$1.P$31 73.41,32 v73.53,31.88 | SV9.9 SV11.9
  Bottom 0.152: SV11.9 50.83,8.91 66.4,8.91 69.77,12.29 69.77,29.01 72.64,31.88 v73.53,31.88
CCARD_33  (via drill 0.35)
  Top 0.152: U$1.P$33 72.48,32.8 v72.64,32.64 | SV9.10 SV11.10
  Bottom 0.152: SV11.10 48.59,9.22 66.27,9.22 69.47,12.41 69.47,29.46 v72.64,32.64
CCARD_34
  Top 0.152: SV10.9 SV12.9 20.55,9.12 36.15,9.12 59.83,32.8 U$1.P$34
CCARD_36
  Top 0.152: SV10.10 SV12.10 18.31,9.42 36.02,9.42 60.2,33.6 U$1.P$36
CCARD_37  (via drill 0.35)
  Top 0.152: U$1.P$37 73.42,34.4 v73.53,34.29 | SV9.11 SV11.11
  Bottom 0.152: SV11.11 46.35,9.53 66.15,9.53 69.16,12.54 69.16,30.56 72.9,34.29 v73.53,34.29
CCARD_39  (via drill 0.35)
  Top 0.152: U$1.P$39 72.5,35.2 v72.64,35.05 | SV9.12 SV11.12
  Bottom 0.152: SV11.12 44.12,9.83 66.02,9.83 68.86,12.67 68.86,31.27 v72.64,35.05
CCARD_40
  Top 0.152: SV10.11 SV12.11 16.08,9.73 35.9,9.73 61.37,35.2 U$1.P$40
CCARD_42
  Top 0.152: SV10.12 SV12.12 13.84,10.03 35.77,10.03 61.74,36 U$1.P$42
DGND  (via drill 0.35)
  Top 0.152: U$1.P$111 67.93,67.2 v67.94,67.18 | U$1.P$97 v67.94,61.6 v67.94,61.59 | U$1.P$83 v67.94,56 v67.94,56.01 | U$1.P$65 67.91,48.8 v67.94,48.77 | U$1.P$46 64.52,37.6 v65.02,38.1 65.32,38.4 U$1.P$47 | U$1.P$38 64.66,34.4 64.77,34.29 | 64.77,34.29 v65.02,34.04 | U$1.P$35 65.46,33.6 64.77,34.29 | U$1.P$22 64.71,28 v65.02,27.69 | U$1.P$19 65.51,27.2 v65.02,27.69 | U$1.P$7 65.36,22.4 v65.02,22.73 | U$1.P$10 64.56,23.2 v65.02,22.73 | U$2.P$37 v68.06,105.8 v68.07,105.79 | U$2.P$59 66.7,115.67 v66.67,115.7 | U$1.P$13 65.69,24.8 65.02,24.13 v65.02,22.73 | U$1.P$16 64.21,25.6 65.02,26.42 v65.02,27.69 | U$1.P$29 67.9,31.2 v67.94,31.24 | LF_INV.7 v40.64,42.42 | HEXINV_1.7 v49.53,62.87 | HEXINV_2.7 v49.53,75.56 | HEXINV_3.7 v49.53,88.39 | HEXINV_4.7 v49.53,101.09 | v67.94,97.03 67.92,97 U$2.P$15
  Top 0.229: v26.67,21.59 5V.C
  Top 0.305: 10.74,21.26 v10.79,21.21
  Top 0.457: X1.5 10.74,21.26
  pour Bottom: 0,130.81 76.2,130.81 76.2,0 0,0
EPWM1A_00  (via drill 0.35)
  Top 0.152: HEXINV_1.1 41.82,64.94 | 41.82,64.94 41.02,65.73 32.89,65.73 26.98,59.82 24,59.82 SV1.1 | U$1.P$49 64.69,39.2 64.26,39.62 64.26,41.81 63.91,42.16 62.36,42.16 60.07,39.88 v58.42,39.88 | 41.82,64.94 41.82,64.22 43.05,62.99 44.32,62.99 45.47,61.85 v45.47,46.61
  Bottom 0.152: v58.42,39.88 52.32,39.88 45.59,46.61 v45.47,46.61
EPWM1B_01  (via drill 0.35)
  Top 0.152: SV1.2 24.13,62.23 26.24,62.23 30.37,66.36 43.25,66.36 44.45,65.17 HEXINV_1.3 44.45,63.45 46.1,61.8 v46.1,47.37 | U$1.P$51 65.03,40 64.64,40.39 64.64,41.86 64.04,42.47 62.23,42.47 60.4,40.64 v59.05,40.64
  Bottom 0.152: v59.05,40.64 52.58,40.64 46.1,47.12 v46.1,47.37
EPWM2A_02  (via drill 0.35)
  Top 0.152: SV1.3 24.13,64.77 26.54,64.77 28.75,66.97 45.18,66.97 46.99,65.17 HEXINV_1.5 46.86,64.72 v46.86,48.13 | U$1.P$53 66.54,40.64 65.41,40.64 64.95,41.1 64.95,41.99 64.16,42.77 62.1,42.77 60.73,41.4 v59.69,41.4
  Bottom 0.152: v59.69,41.4 52.83,41.4 46.86,47.37 v46.86,48.13
EPWM2B_03  (via drill 0.35)
  Top 0.152: HEXINV_1.9 48.26,69.6 | 48.26,69.6 48.26,69.45 46.39,67.58 42.58,67.58 42.54,67.61 26.72,67.61 26.42,67.31 24.13,67.31 SV1.4 | U$1.P$55 65.77,41.6 64.29,43.08 61.98,43.08 61.06,42.16 v60.33,42.16 | v48.26,67.31 48.26,69.6
  Bottom 0.152: v60.33,42.16 59.31,42.16 59.05,41.91 53.72,41.91 53.34,42.29 53.34,43.05 53.85,43.56 53.85,52.7 56.01,54.86 56.01,58.04 56.01,66.42 55.5,66.93 55.12,67.31 v48.26,67.31
EPWM3A_04  (via drill 0.35)
  Top 0.152: HEXINV_1.11 45.72,69.72 | 45.72,69.72 45.72,69.45 44.19,67.92 28.35,67.92 26.42,69.85 24.13,69.85 SV1.5 | U$1.P$50 63.23,39.13 62.06,39.13 60.89,37.95 54.27,37.95 50.98,41.25 50.98,71.32 50.93,71.37 v50.93,71.75 | v45.72,71.75 45.72,69.72
  Bottom 0.152: v50.93,71.75 v45.72,71.75
EPWM3B_05  (via drill 0.35)
  Top 0.152: SV1.6 24.13,72.39 26.16,72.39 30.33,68.22 41.95,68.22 43.18,69.45 HEXINV_1.13 v43.18,71.75 | U$1.P$52 62.98,39.68 62.18,39.68 60.85,38.35 54.38,38.35 51.44,41.3 51.44,70.48 v52.07,71.12
  Bottom 0.152: v43.18,71.75 43.81,71.12 v52.07,71.12
EPWM4A_06
  Top 0.152: SV1.7 24.13,74.93 26.67,74.93 30.18,78.44 41.02,78.44 HEXINV_2.1 41.91,76.47 44.59,73.79 50.55,73.79 52.7,71.63 52.7,70.61 51.92,69.83 51.92,41.25 54.4,38.77 60.38,38.77 62.41,40.8 U$1.P$54
EPWM4B_07
  Top 0.152: SV1.8 24.11,77.5 26.26,77.5 27.81,79.05 41.38,79.05 41.41,79.06 43.25,79.06 44.45,77.87 HEXINV_2.3 44.45,76.33 46.67,74.12 50.85,74.12 53.24,71.73 53.24,70.64 52.32,69.72 52.32,41.27 54.41,39.19 60.25,39.19 62.66,41.6 U$1.P$56
EPWM5A_08  (via drill 0.35)
  Top 0.152: SV1.9 24.13,80.01 26.04,80.01 26.36,79.68 45.18,79.68 46.99,77.87 HEXINV_2.5 46.99,76.07 48.64,74.42 v56.39,74.42 | U$1.P$57 66.57,45.6 65.93,44.96 56.26,44.96 v56.13,44.83
  Bottom 0.152: v56.13,44.83 56.13,52.7 57.35,53.92 57.35,73.46 v56.39,74.42
EPWM5B_09  (via drill 0.35)
  Top 0.152: SV1.10 24.13,82.55 26.29,82.55 28.55,80.29 46.4,80.29 48.26,82.15 HEXINV_2.9 48.39,82.35 48.39,81.28 54.23,75.44 v54.99,75.44 | U$1.P$59 66.75,46.35 67.44,46.35 67.69,46.1 67.69,45.42 66.85,44.58 56.9,44.58 56.39,44.07 v55.5,44.07
  Bottom 0.152: v54.99,75.44 54.99,74.68 57.02,72.64 57.02,54.1 55.5,52.58 v55.5,44.07
EPWM6A_10  (via drill 0.35)
  Top 0.152: SV1.11 24.13,85.09 26.04,85.09 30.53,80.59 44.16,80.59 45.72,82.15 HEXINV_2.11 v45.72,84.45 | U$1.P$61 66.76,47.26 67.52,47.26 68,46.78 68,45.29 66.9,44.2 57.02,44.2 56.13,43.31 v54.86,43.31
  Bottom 0.152: v45.72,84.45 45.72,83.31 56.64,72.39 56.64,54.36 54.86,52.58 v54.86,43.31
EPWM6B_11  (via drill 0.35)
  Top 0.152: SV1.12 24.13,87.63 26.16,87.63 32.89,80.9 41.93,80.9 43.18,82.15 HEXINV_2.13 v43.18,84.36 | U$1.P$63 66.76,48.06 67.52,48.06 68.3,47.28 68.3,45.16 66.95,43.81 57.15,43.81 55.88,42.55 v54.23,42.55
  Bottom 0.152: v43.18,84.36 44.35,83.19 45.42,83.19 56.34,72.26 56.34,54.69 54.23,52.58 v54.23,42.55
EPWM7A_12  (via drill 0.35)
  Top 0.152: HEXINV_3.1 41.88,90.27 | 41.88,90.27 41.02,91.14 27,91.14 26.19,90.32 23.98,90.32 SV2.1 | U$1.P$58 58.54,45.6 v58.42,45.72 | v53.72,84.33 50.67,84.33 47.09,87.91 43.04,87.91 41.88,89.06 41.88,90.27
  Bottom 0.152: v58.42,45.72 56.64,47.5 56.64,52.7 57.66,53.72 57.66,80.39 v53.72,84.33
EPWM7B_13  (via drill 0.35)
  Top 0.152: SV2.2 22.86,93.85 24.13,92.58 26.29,92.58 27.13,91.75 41.38,91.75 41.41,91.77 43.25,91.77 44.45,90.57 HEXINV_3.3 44.45,89.61 45.85,88.21 47.43,88.21 50.05,85.6 v53.72,85.6 | U$1.P$60 59.14,46.4 v59.05,46.48
  Bottom 0.152: v53.72,85.6 58.04,81.28 58.04,53.59 57.02,52.58 57.02,48.51 v59.05,46.48
EPWM8A_14  (via drill 0.35)
  Top 0.152: SV2.3 24.13,95.25 26.04,95.25 28.93,92.35 41.13,92.35 41.15,92.37 45.18,92.37 46.99,90.57 HEXINV_3.5 46.99,89.42 49.54,86.87 v53.72,86.87 | U$1.P$62 59.73,47.2 v59.69,47.24
  Bottom 0.152: v59.69,47.24 59.05,47.24 57.4,48.9 57.4,52.45 58.42,53.47 58.42,82.17 v53.72,86.87
EPWM8B_15  (via drill 0.35)
  Top 0.152: HEXINV_3.9 48.26,95 | 48.26,95 48.26,94.85 46.39,92.98 30.97,92.98 26.16,97.79 24.13,97.79 SV2.4 | U$1.P$64 v60.33,48 v60.33,48.01 | v53.72,88.14 53.72,89.03 48.26,94.49 48.26,95
  Bottom 0.152: v60.33,48.01 58.93,48.01 57.78,49.15 57.78,52.32 58.8,53.34 58.8,83.06 v53.72,88.14
EPWM9A_16  (via drill 0.35)
  Top 0.152: SV2.5 24.13,100.33 26.04,100.33 33.08,93.29 44.16,93.29 45.72,94.85 HEXINV_3.11 45.72,97.92 v45.73,97.93 | v53.72,97.79 63.73,87.78 67.18,87.78 71.25,83.72 71.25,52.43 68.42,49.6 U$1.P$67
  Bottom 0.152: v45.73,97.93 53.58,97.93 v53.72,97.79
EPWM9B_17  (via drill 0.35)
  Top 0.152: SV2.6 24.13,102.87 26.04,102.87 35.31,93.59 41.92,93.59 43.18,94.85 HEXINV_3.13 v43.18,97.16 | v53.72,96.65 62.89,87.48 67.06,87.48 70.87,83.67 70.87,52.48 68.72,50.34 66.76,50.34 U$1.P$69
  Bottom 0.152: v43.18,97.16 53.21,97.16 v53.72,96.65
EPWM10A_18
  Top 0.152: SV2.7 24.13,105.41 27.94,105.41 29.52,103.83 41.02,103.83 HEXINV_4.1 41.91,102.12 43.57,100.46 46.99,100.46 60.58,86.87 66.8,86.87 69.34,84.33 69.34,51.82 68.73,51.2 U$1.P$71
EPWM10B_19  (via drill 0.35)
  Top 0.152: SV2.8 24.13,107.95 26.26,107.95 29.75,104.47 43.25,104.47 44.45,103.26 HEXINV_4.3 44.45,102.11 45.67,100.89 47.37,100.89 61.09,87.17 66.93,87.17 70.28,83.82 70.28,52.76 v70.23,52.7 | U$1.P$73 68,52 v68.07,52.07
  Bottom 0.152: v68.07,52.07 69.6,52.07 v70.23,52.7
EPWM11A_20  (via drill 0.35)
  Top 0.152: SV2.9 24.13,110.49 26.16,110.49 31.57,105.08 45.18,105.08 46.99,103.26 HEXINV_4.5 46.99,101.96 48.9,100.05 53.7,100.05 v53.72,100.08 | v58.42,49.78 58.55,49.66 63.24,49.66 U$1.P$68
  Bottom 0.152: v53.72,100.08 59.18,94.61 59.18,53.21 58.42,52.45 v58.42,49.78
EPWM11B_21  (via drill 0.35)
  Top 0.152: SV2.10 24.13,113.03 26.16,113.03 33.5,105.69 46.4,105.69 48.27,107.56 HEXINV_4.9 49.02,107.12 49.02,106.79 53.72,102.09 v53.72,101.09 | v59.05,50.55 59.2,50.4 U$1.P$70
  Bottom 0.152: v59.05,50.55 59.05,52.58 59.56,53.09 59.56,95.25 v53.72,101.09
EPWM12A_22  (via drill 0.35)
  Top 0.152: SV2.11 24.13,115.57 26.16,115.57 35.74,105.99 44.16,105.99 45.73,107.56 HEXINV_4.11 v45.72,109.98 | U$1.P$72 63.28,51.18 59.82,51.18 v59.69,51.31
  Bottom 0.152: v45.72,109.98 59.94,95.76 59.94,52.96 59.69,52.7 v59.69,51.31
EPWM12B_23  (via drill 0.35)
  Top 0.152: SV2.12 24.13,118.11 26.04,118.11 37.85,106.3 41.93,106.3 43.19,107.56 HEXINV_4.13 v43.18,109.98 | v60.33,52.07 63.23,52.07 U$1.P$74
  Bottom 0.152: v43.18,109.98 43.94,110.74 45.85,110.74 55.24,101.35 60.33,96.27 v60.33,52.07
LF_LEG_0  (via drill 0.35)
  Top 0.152: SV22.1 8.64,42.16 30.66,42.16 LF_INV.1 v33.02,42.67 | v53.34,61.58 53.57,61.58 55.16,63.16 62.03,63.16 62.79,62.4 U$1.P$100
  Bottom 0.152: v33.02,42.67 33.91,42.67 34.67,41.91 35.94,41.91 42.93,48.9 42.93,52.07 52.43,61.58 v53.34,61.58
LF_LEG_1  (via drill 0.35)
  Top 0.152: SV22.2 10.87,42.47 28.88,42.47 32.26,45.85 34.56,45.85 35.56,44.85 LF_INV.3 35.56,42.67 v35.43,42.55 | v53.34,62.48 53.85,62.48 54.95,63.58 62.16,63.58 62.54,63.2 U$1.P$102
  Bottom 0.152: v35.43,42.55 35.43,43.94 42.55,51.05 42.55,52.58 52.45,62.48 v53.34,62.48
LF_LEG_2  (via drill 0.35)
  Top 0.152: SV22.3 13.11,42.77 28.75,42.77 32.13,46.15 36.8,46.15 38.1,44.85 LF_INV.5 38.86,45.28 38.86,45.61 41.78,48.53 v41.78,51.56 | U$1.P$104 54.73,64 54.23,63.5 v53.34,63.5
  Bottom 0.152: v41.78,51.56 41.91,51.69 41.91,52.55 52.85,63.5 v53.34,63.5
LF_LEG_3  (via drill 0.35)
  Top 0.152: SV22.4 14.91,43.51 22.53,43.51 26.65,47.63 37.87,47.63 39.37,49.13 LF_INV.9 v39.37,51.56 | v53.98,64.39 60.58,64.39 60.99,64.8 U$1.P$106
  Bottom 0.152: v39.37,51.56 40.66,52.86 41.78,52.86 53.31,64.39 v53.98,64.39
LF_LEG_4  (via drill 0.35)
  Top 0.152: SV22.5 17.14,43.81 22.4,43.81 26.54,47.95 32.49,47.95 32.52,47.94 35.63,47.94 36.83,49.13 LF_INV.11 v36.83,51.56 | v54.61,65.28 55.19,64.69 60.38,64.69 61.28,65.6 U$1.P$108
  Bottom 0.152: v36.83,51.56 38.43,53.16 41.66,53.16 53.72,65.23 54.56,65.23 v54.61,65.28
LF_LEG_5  (via drill 0.35)
  Top 0.152: SV22.6 23.88,45.72 26.42,48.26 32.62,48.26 32.64,48.24 33.4,48.24 34.29,49.13 LF_INV.13 v34.29,51.56 | U$1.P$110 61.52,66.4 60.12,65 56.41,65 v55.24,66.17
  Bottom 0.152: v34.29,51.56 36.2,53.47 40.77,53.47 41.4,53.47 54.1,66.17 v55.24,66.17
LF_PHASE_U
  Top 0.152: SV23.1 5.08,59.69 SV5.1 SV5.2 SV5.3 SV5.4 SV5.5 SV5.6 SV5.7 SV5.8 SV5.9 SV5.10 SV5.11 SV5.12 SV6.1 SV6.2 SV6.3 SV6.4 SV6.5 SV6.6 SV6.7 SV6.8 SV6.9 SV6.10 SV6.11 SV6.12
LF_PHASE_V
  Top 0.152: SV23.3 SV13.1 SV13.2 SV13.3 SV13.4 SV13.5 SV13.6 SV13.7 SV13.8 SV13.9 SV13.10 SV13.11 SV13.12 SV14.1 SV14.2 SV14.3 SV14.4 SV14.5 SV14.6 SV14.7 SV14.8 SV14.9 SV14.10 SV14.11 SV14.12
LF_PHASE_W
  Top 0.152: SV23.5 15.24,59.69 SV17.1 SV17.2 SV17.3 SV17.4 SV17.5 SV17.6 SV17.7 SV17.8 SV17.9 SV17.10 SV17.11 SV17.12 SV18.1 SV18.2 SV18.3 SV18.4 SV18.5 SV18.6 SV18.7 SV18.8 SV18.9 SV18.10 SV18.11 SV18.12
MMC_5V_SRC
  Top 0.61: J1.1 15.37,33.02 20.7,27.69 SRC-SEL.3
N$1
  Top 0.457: X1.1 14.68,24.46 SRC-SEL.1
N$4
  Top 0.229: R1.1 5V.A

### Text on the board
tNames: LF_U | !LF_U | LF_V | !LF_V | LF_W | !LF_W | HF_PWM | !HF_PWM | PWM_23 | PWM_00 | !LF | LF | GPIO54 | GPIO55 | GPIO56 | GPIO57 | GPIO58 | GPIO59 | DGND | +5V
bNames: 3 Phase MMC DSP to inverter interface / Designed by Tristan French